# EAGLE schematic Processor (EAGLE 9.3.0)
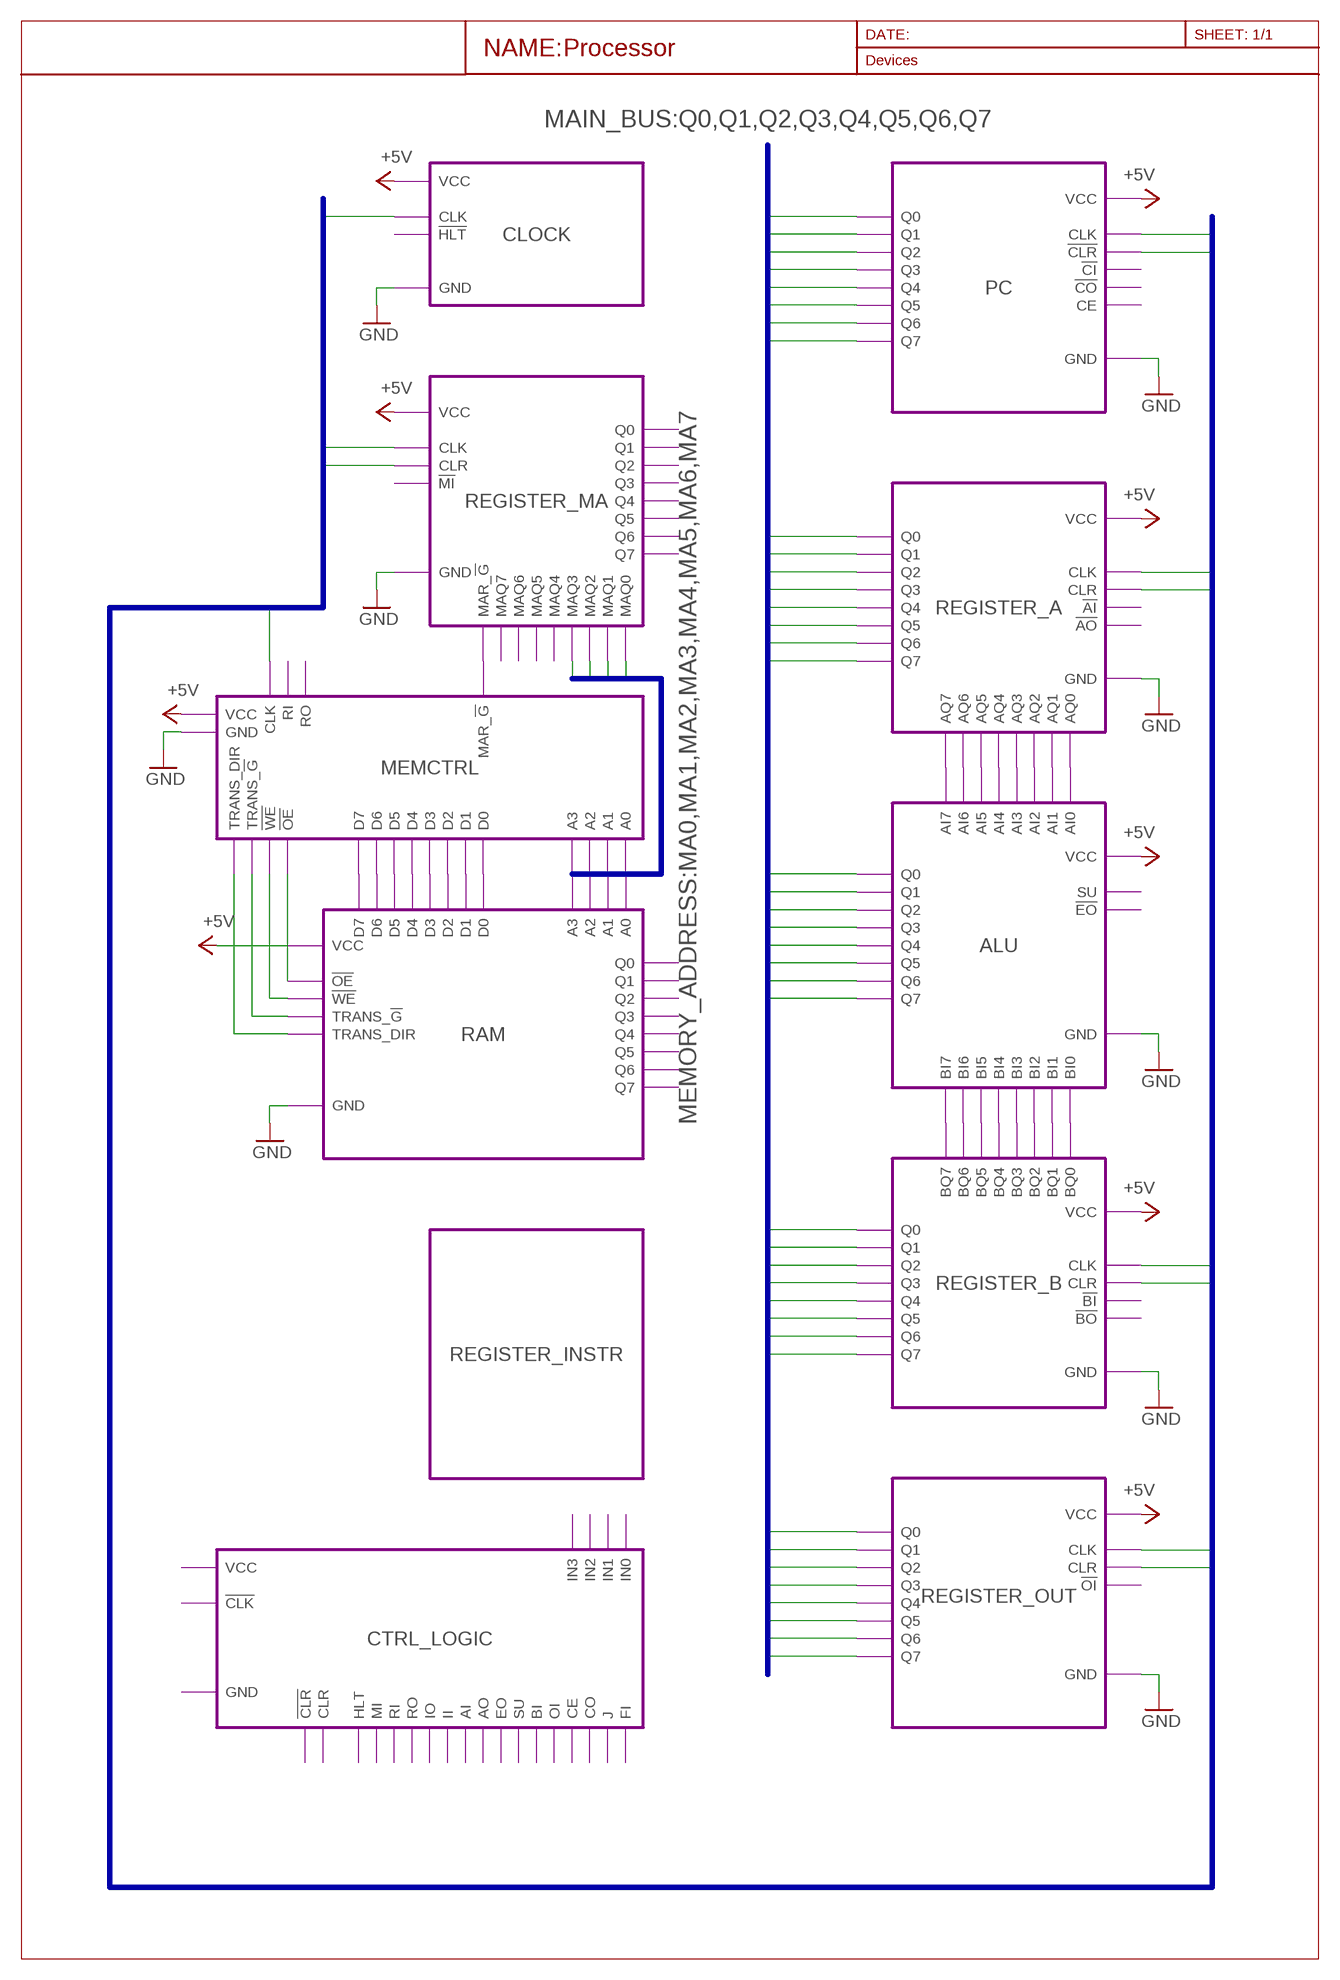
[diagram p0: schematic, sheet 1]

## Module instances
REGISTER_A = REGISTER_A
REGISTER_B = REGISTER_B
ALU = ALU
REGISTER_OUT = REGISTER_OUT
PC = PC
CLOCK = CLOCK
REGISTER_MA = REGISTER_MA
RAM = RAM
MEMCTRL = MEMCTRL
REGISTER_INSTR = REGISTER_INSTR
CTRL_LOGIC = CTRL_LOGIC

## Nets
!CLR: port PC.!CLR
+5V: port REGISTER_B.VCC ALU.VCC REGISTER_A.VCC REGISTER_OUT.VCC PC.VCC CLOCK.VCC REGISTER_MA.VCC RAM.VCC MEMCTRL.VCC
CLK: port PC.CLK REGISTER_A.CLK REGISTER_B.CLK REGISTER_OUT.CLK MEMCTRL.CLK REGISTER_MA.CLK CLOCK.CLK
CLR: port REGISTER_A.CLR REGISTER_B.CLR REGISTER_OUT.CLR REGISTER_MA.CLR
GND: port REGISTER_A.GND ALU.GND REGISTER_B.GND REGISTER_OUT.GND PC.GND CLOCK.GND REGISTER_MA.GND RAM.GND MEMCTRL.GND
MA0: port REGISTER_MA.MAQ0 MEMCTRL.A0 RAM.A0
MA1: port REGISTER_MA.MAQ1 MEMCTRL.A1 RAM.A1
MA2: port REGISTER_MA.MAQ2 MEMCTRL.A2 RAM.A2
MA3: port REGISTER_MA.MAQ3 MEMCTRL.A3 RAM.A3
N$5: port REGISTER_MA.MAR_!G MEMCTRL.MAR_!G
N$18: port REGISTER_A.AQ7 ALU.AI7
N$19: port REGISTER_A.AQ6 ALU.AI6
N$27: port MEMCTRL.D7 RAM.D7
N$28: port MEMCTRL.D6 RAM.D6
N$29: port REGISTER_A.AQ5 ALU.AI5
N$30: port MEMCTRL.D5 RAM.D5
N$45: port REGISTER_A.AQ4 ALU.AI4
N$46: port REGISTER_A.AQ3 ALU.AI3
N$47: port REGISTER_A.AQ2 ALU.AI2
N$48: port REGISTER_A.AQ1 ALU.AI1
N$49: port REGISTER_A.AQ0 ALU.AI0
N$50: port ALU.BI0 REGISTER_B.BQ0
N$51: port MEMCTRL.D4 RAM.D4
N$52: port ALU.BI1 REGISTER_B.BQ1
N$53: port ALU.BI2 REGISTER_B.BQ2
N$54: port ALU.BI3 REGISTER_B.BQ3
N$55: port ALU.BI4 REGISTER_B.BQ4
N$56: port ALU.BI5 REGISTER_B.BQ5
N$57: port ALU.BI6 REGISTER_B.BQ6
N$58: port ALU.BI7 REGISTER_B.BQ7
N$59: port MEMCTRL.D3 RAM.D3
N$60: port MEMCTRL.D2 RAM.D2
N$61: port MEMCTRL.D1 RAM.D1
N$62: port MEMCTRL.D0 RAM.D0
N$63: port RAM.TRANS_DIR MEMCTRL.TRANS_DIR
N$64: port RAM.TRANS_!G MEMCTRL.TRANS_!G
N$65: port RAM.!WE MEMCTRL.!WE
N$66: port RAM.!OE MEMCTRL.!OE
Q0: port REGISTER_A.Q0 ALU.Q0 REGISTER_B.Q0 REGISTER_OUT.Q0 PC.Q0
Q1: port REGISTER_A.Q1 ALU.Q1 REGISTER_B.Q1 REGISTER_OUT.Q1 PC.Q1
Q2: port REGISTER_A.Q2 ALU.Q2 REGISTER_B.Q2 REGISTER_OUT.Q2 PC.Q2
Q3: port REGISTER_A.Q3 ALU.Q3 REGISTER_B.Q3 REGISTER_OUT.Q3 PC.Q3
Q4: port REGISTER_A.Q4 ALU.Q4 REGISTER_B.Q4 REGISTER_OUT.Q4 PC.Q4
Q5: port REGISTER_A.Q5 ALU.Q5 REGISTER_B.Q5 REGISTER_OUT.Q5 PC.Q5
Q6: port REGISTER_A.Q6 ALU.Q6 REGISTER_B.Q6 REGISTER_OUT.Q6 PC.Q6
Q7: port REGISTER_A.Q7 ALU.Q7 REGISTER_B.Q7 REGISTER_OUT.Q7 PC.Q7

## Buses
MAIN_BUS:Q0,Q1,Q2,Q3,Q4,Q5,Q6,Q7
MEMORY_ADDRESS:MA0,MA1,MA2,MA3,MA4,MA5,MA6,MA7
CTRL_BUS:CLK,CLR,!CLR

## Library data of the parts

## Module REGISTER_A
Ports: Q0(io) Q1(io) Q2(io) Q3(io) Q4(io) Q5(io) Q6(io) Q7(io) AQ7(out) AQ6(out) AQ5(out) AQ4(out) AQ3(out) AQ2(out) AQ1(out) AQ0(out) CLK(in) CLR(in) !AI(in) !AO(in) VCC(pwr) GND(pwr)
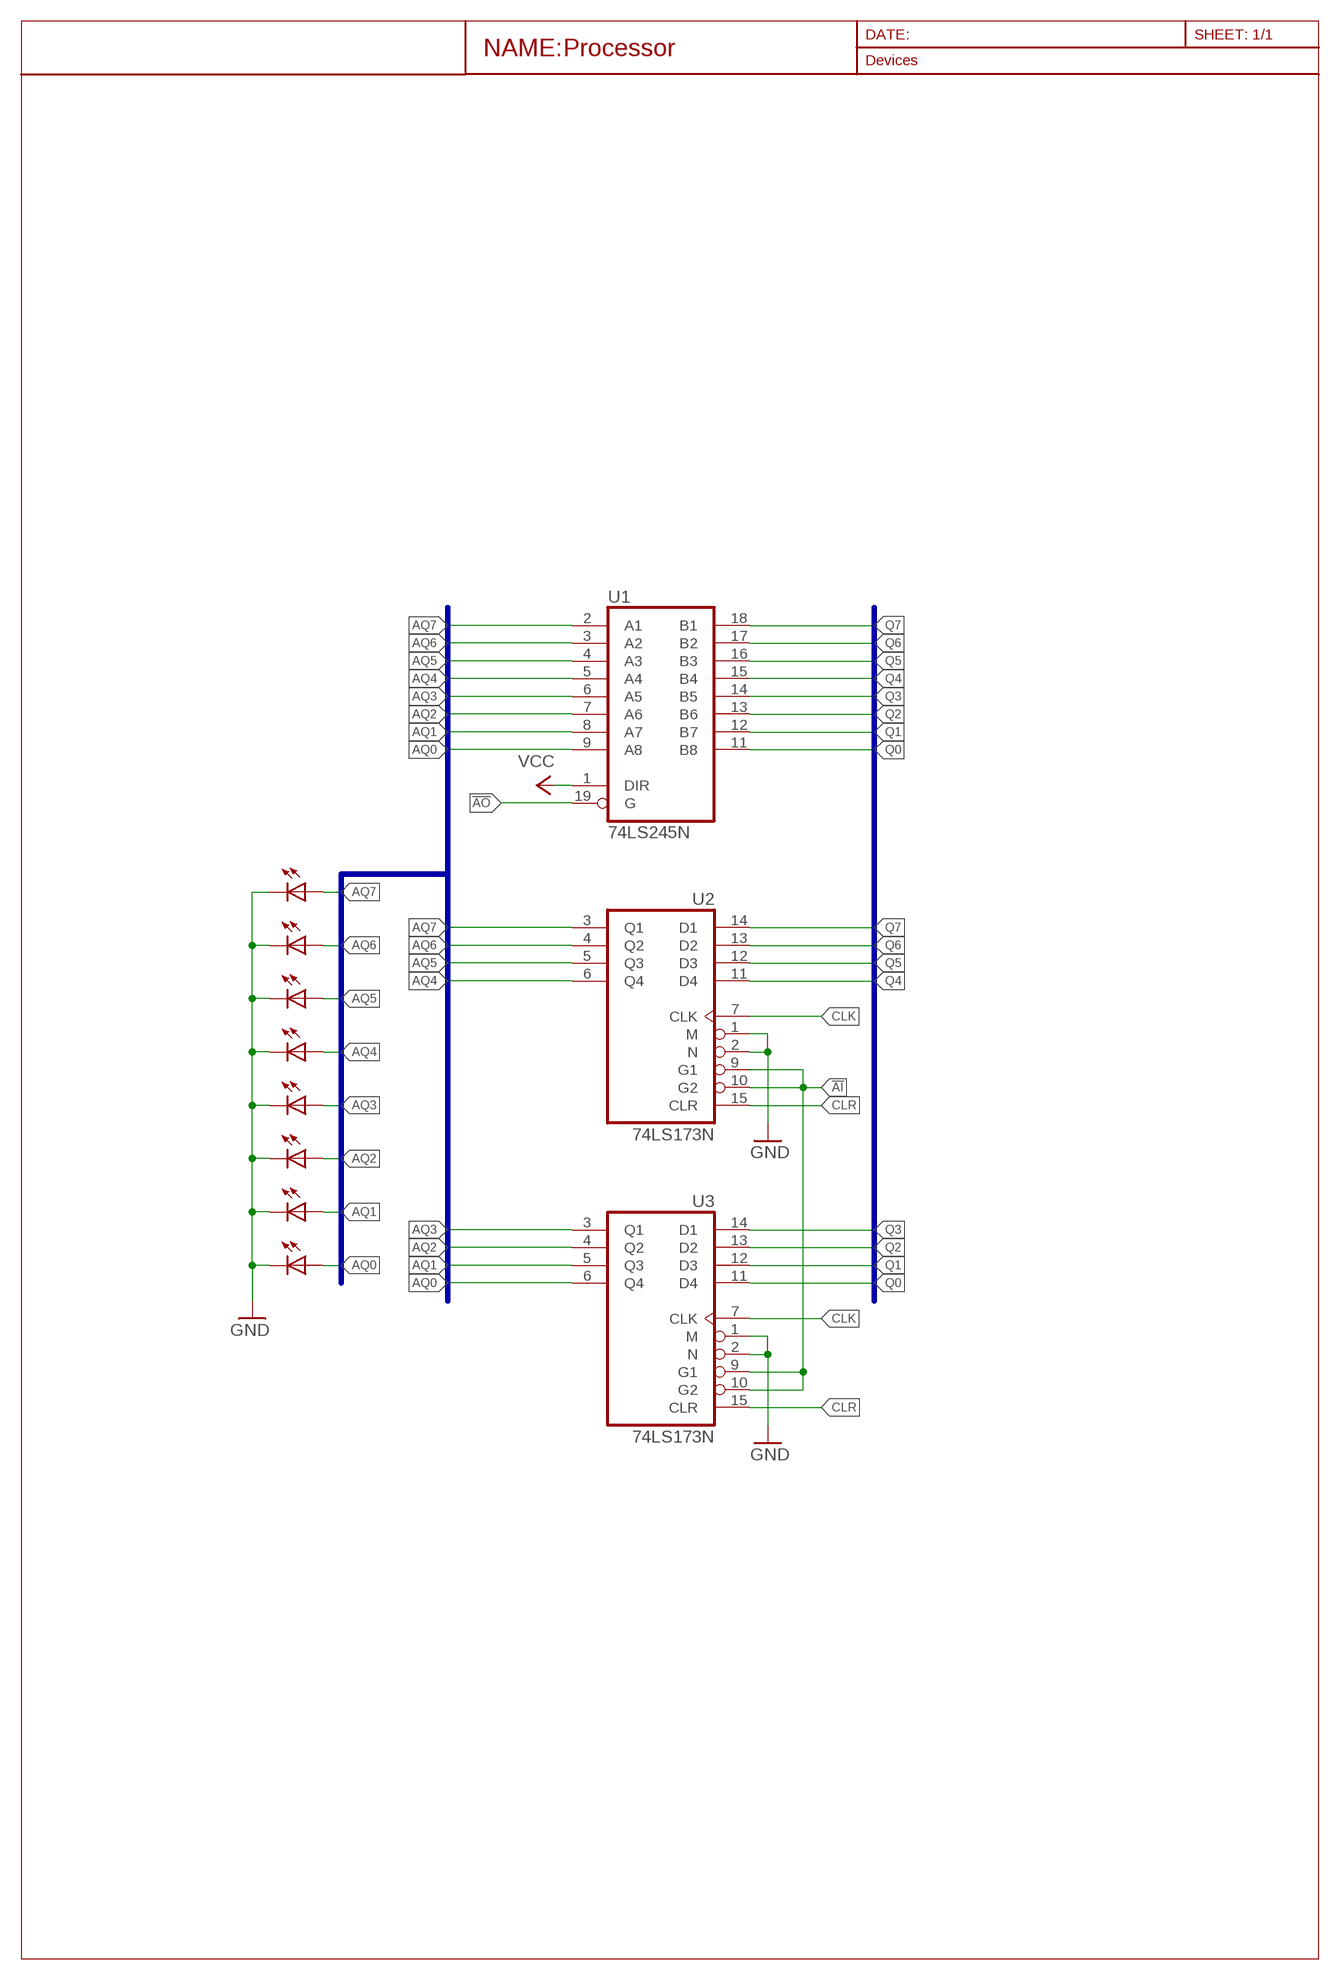
[diagram p1: schematic, module REGISTER_A, sheet 1]

### Parts
LED1  LED5MM  [LED5MM]
LED2  LED5MM  [LED5MM]
LED3  LED5MM  [LED5MM]
LED4  LED5MM  [LED5MM]
LED5  LED5MM  [LED5MM]
LED6  LED5MM  [LED5MM]
LED7  LED5MM  [LED5MM]
LED8  LED5MM  [LED5MM]
U1  74LS245N  [DIL20]
U2  74LS173N  [DIL16]
U3  74LS173N  [DIL16]

### Nets
!AI: U2.9(G1) U2.10(G2) U3.9(G1) U3.10(G2)
!AO: U1.19(G)
AQ0: LED1.A U1.9(A8) U3.6(Q4)
AQ1: LED2.A U1.8(A7) U3.5(Q3)
AQ2: LED3.A U1.7(A6) U3.4(Q2)
AQ3: LED4.A U1.6(A5) U3.3(Q1)
AQ4: LED5.A U1.5(A4) U2.6(Q4)
AQ5: LED6.A U1.4(A3) U2.5(Q3)
AQ6: LED7.A U1.3(A2) U2.4(Q2)
AQ7: LED8.A U1.2(A1) U2.3(Q1)
CLK: U2.7(CLK) U3.7(CLK)
CLR: U2.15(CLR) U3.15(CLR)
GND: LED1.K(C) LED2.K(C) LED3.K(C) LED4.K(C) LED5.K(C) LED6.K(C) LED7.K(C) LED8.K(C) U2.1(M) U2.2(N) U3.1(M) U3.2(N)
Q0: U1.11(B8) U3.11(D4)
Q1: U1.12(B7) U3.12(D3)
Q2: U1.13(B6) U3.13(D2)
Q3: U1.14(B5) U3.14(D1)
Q4: U1.15(B4) U2.11(D4)
Q5: U1.16(B3) U2.12(D3)
Q6: U1.17(B2) U2.13(D2)
Q7: U1.18(B1) U2.14(D1)
VCC: U1.1(DIR)

### Buses
AQ0,AQ1,AQ2,AQ3,AQ4,AQ5,AQ6,AQ7
Q0,Q1,Q2,Q3,Q4,Q5,Q6,Q7

### Power pins joined to a net without a drawn wire
GND: U1.10(GND) U2.8(GND) U3.8(GND)
VCC: U1.20(VCC) U2.16(VCC) U3.16(VCC)

### Library data of the parts
LED1-LED8 = led:LED: LED OSRAM: - CHIPLED LG R971, LG N971, LY N971, LG Q971, LY Q971, LO R971, LY R971 LH N974, LH R974 LS Q976, LO Q976, LY Q976 LO Q996 - Hyper CHIPLED LW Q18S LB Q993, LB Q99A, LB R99A - SideLED LS A670, LO A670, LY A670, LG A670, LP A670 LB A673, LV A673, LT A673, LW A673 LH A674 LY A675 LS A676, LA A676, LO A676, LY A676, LW A676 LS A679, LY A679, LG A679 - Hyper Micro SIDELED® LS Y876, LA Y876, LO Y876, LY Y876 LT Y87S - SmartLED LW L88C, LW L88S LB L89C, LB L89S, LG L890 LS L89K, LO L89K, LY L89K LS L896, LA L896, LO L896, LY L896 - TOPLED LS T670, LO T670, LY T670, LG T670, LP T670 LSG T670, LSP T670, LSY T670, LOP T670, LYG T670 LG T671, LOG T671, LSG T671 LB T673, LV T673, LT T673, LW T673 LH T674 LS T676, LA T676, LO T676, LY T676, LB T676, LH T676, LSB T676, LW T676 LB T67C, LV T67C, LT T67C, LS T67K, LO T67K, LY T67K, LW E67C LS E67B, LA E67B, LO E67B, LY E67B, LB E67C, LV E67C, LT E67C LW T67C LS T679, LY T679, LG T679 LS T770, LO T770, LY T770, LG T770, LP T770 LB T773, LV T773, LT T773, LW T773 LH T774 LS E675, LA E675, LY E675, LS T675 LS T776, LA T776, LO T776, LY T776, LB T776 LHGB T686 LT T68C, LB T68C - Hyper Mini TOPLED® LB M676 - Mini TOPLED Santana® LG M470 LS M47K, LO M47K, LY M47K Source: http://www.osram.convergy.de LUXEON: - LUMILED® LXK2-PW12-R00, LXK2-PW12-S00, LXK2-PW14-U00, LXK2-PW14-V00 LXK2-PM12-R00, LXK2-PM12-S00, LXK2-PM14-U00 LXK2-PE12-Q00, LXK2-PE12-R00, LXK2-PE12-S00, LXK2-PE14-T00, LXK2-PE14-U00 LXK2-PB12-K00, LXK2-PB12-L00, LXK2-PB12-M00, LXK2-PB14-N00, LXK2-PB14-P00, LXK2-PB14-Q00 LXK2-PR12-L00, LXK2-PR12-M00, LXK2-PR14-Q00, LXK2-PR14-R00 LXK2-PD12-Q00, LXK2-PD12-R00, LXK2-PD12-S00 LXK2-PH12-R00, LXK2-PH12-S00 LXK2-PL12-P00, LXK2-PL12-Q00, LXK2-PL12-R00 Source: www.luxeon.com KINGBRIGHT: KA-3528ASYC Source: www.kingbright.com
U1 = 74xx-eu:74*245: Octal BUS TRANSCEIVER, 3-state
U2 U3 = 74xx-eu:74*173: 4-bit D type REGISTER, 3-state

## Module REGISTER_B
Ports: VCC(pwr) GND(pwr) CLK(in) CLR(in) !BI(in) !BO(in) Q0(io) Q1(io) Q2(io) Q3(io) Q4(io) Q5(io) Q6(io) Q7(io) BQ0(out) BQ1(out) BQ2(out) BQ3(out) BQ4(out) BQ5(out) BQ6(out) BQ7(out)
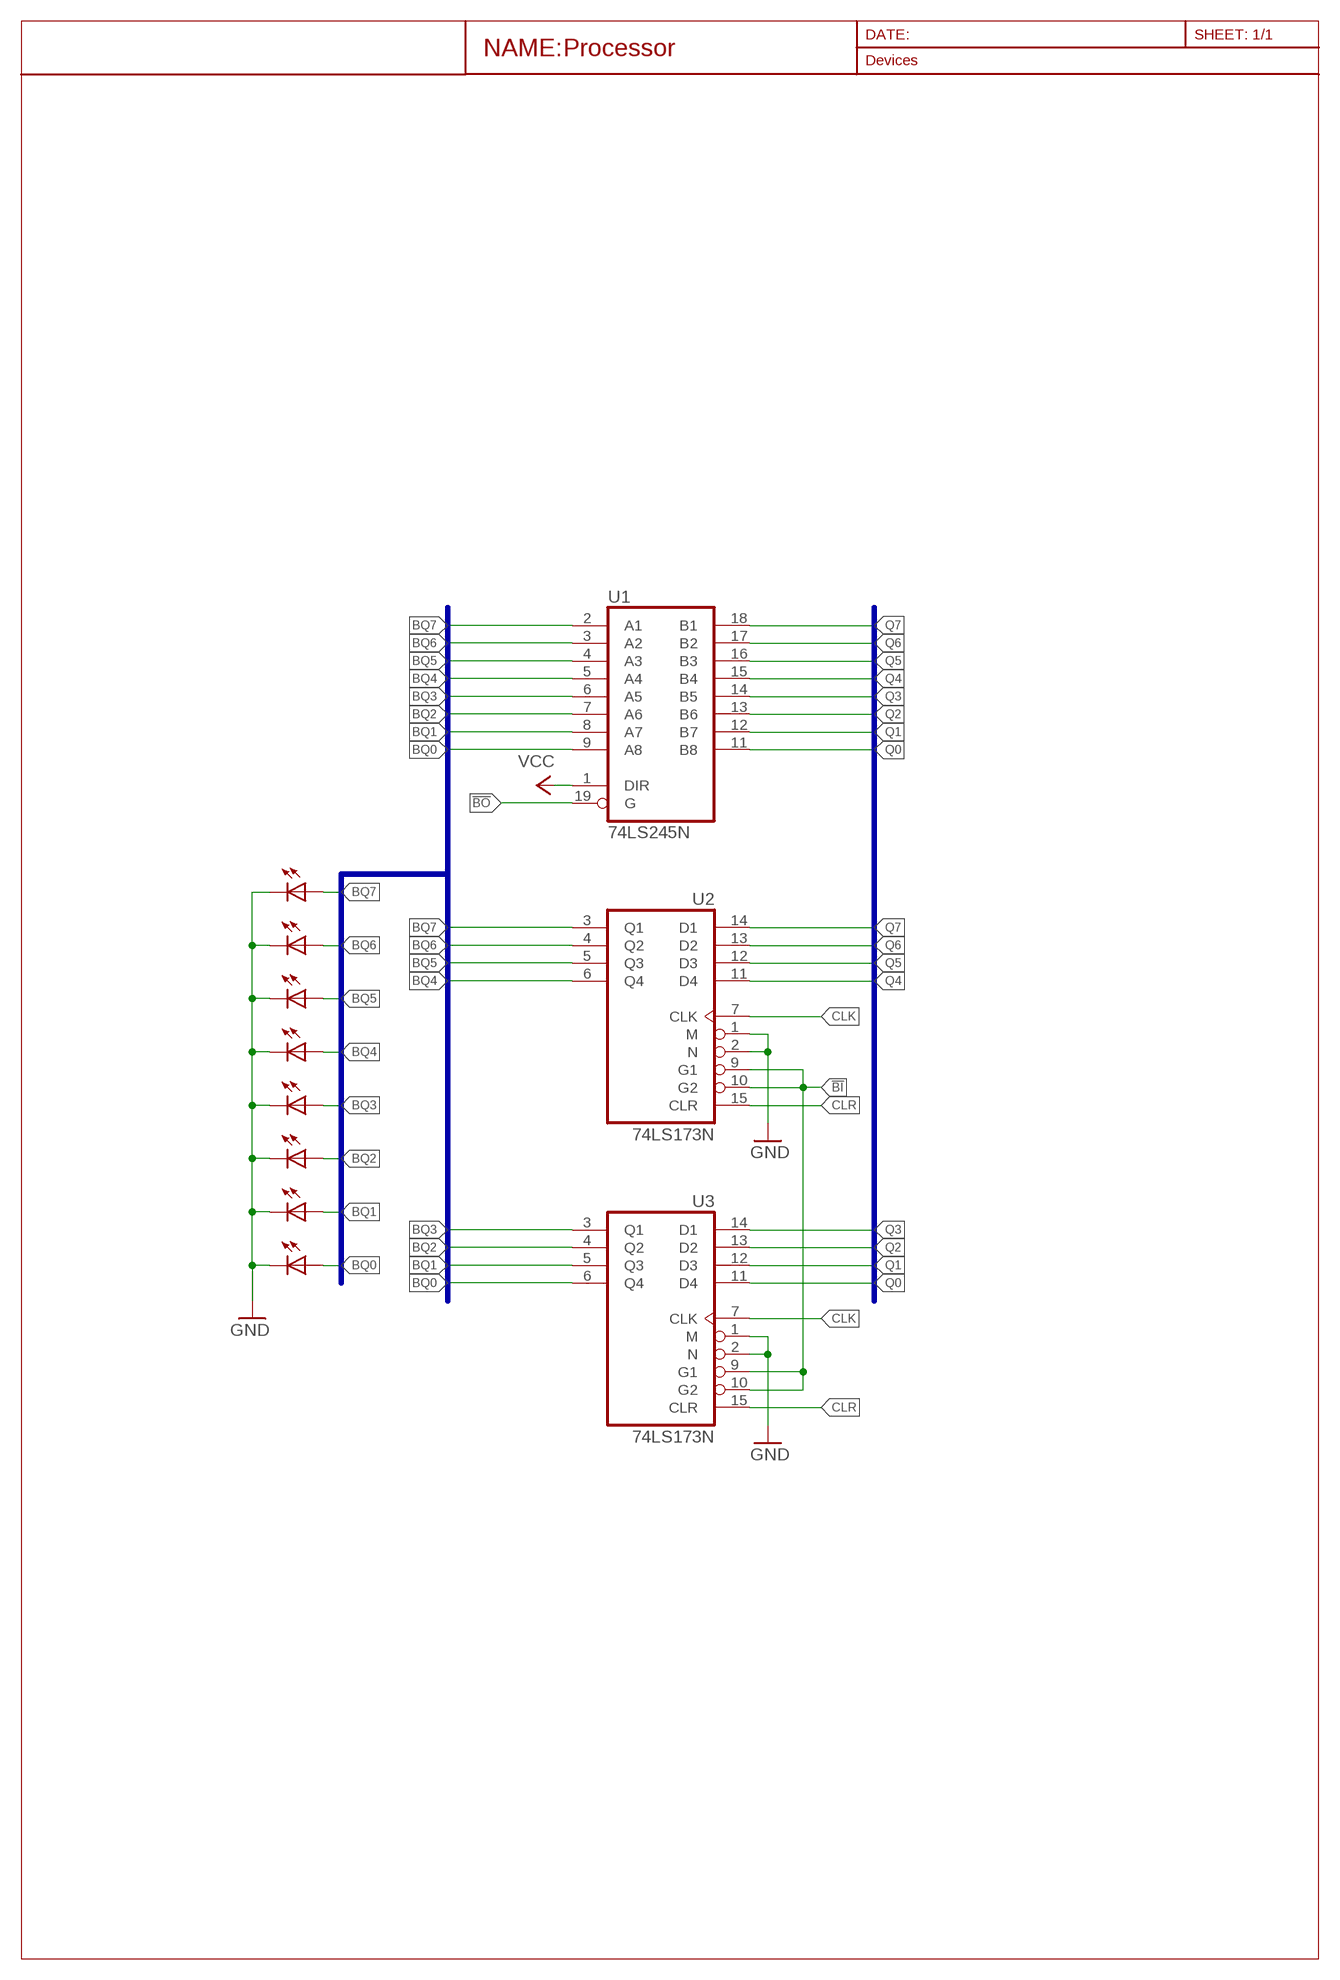
[diagram p2: schematic, module REGISTER_B, sheet 1]

### Parts
LED9  LED5MM  [LED5MM]
LED10  LED5MM  [LED5MM]
LED11  LED5MM  [LED5MM]
LED12  LED5MM  [LED5MM]
LED13  LED5MM  [LED5MM]
LED14  LED5MM  [LED5MM]
LED15  LED5MM  [LED5MM]
LED16  LED5MM  [LED5MM]
U1  74LS245N  [DIL20]
U2  74LS173N  [DIL16]
U3  74LS173N  [DIL16]

### Nets
!BI: U2.9(G1) U2.10(G2) U3.9(G1) U3.10(G2)
!BO: U1.19(G)
BQ0: LED9.A U1.9(A8) U3.6(Q4)
BQ1: LED10.A U1.8(A7) U3.5(Q3)
BQ2: LED11.A U1.7(A6) U3.4(Q2)
BQ3: LED12.A U1.6(A5) U3.3(Q1)
BQ4: LED13.A U1.5(A4) U2.6(Q4)
BQ5: LED14.A U1.4(A3) U2.5(Q3)
BQ6: LED15.A U1.3(A2) U2.4(Q2)
BQ7: LED16.A U1.2(A1) U2.3(Q1)
CLK: U2.7(CLK) U3.7(CLK)
CLR: U2.15(CLR) U3.15(CLR)
GND: LED9.K(C) LED10.K(C) LED11.K(C) LED12.K(C) LED13.K(C) LED14.K(C) LED15.K(C) LED16.K(C) U2.1(M) U2.2(N) U3.1(M) U3.2(N)
Q0: U1.11(B8) U3.11(D4)
Q1: U1.12(B7) U3.12(D3)
Q2: U1.13(B6) U3.13(D2)
Q3: U1.14(B5) U3.14(D1)
Q4: U1.15(B4) U2.11(D4)
Q5: U1.16(B3) U2.12(D3)
Q6: U1.17(B2) U2.13(D2)
Q7: U1.18(B1) U2.14(D1)
VCC: U1.1(DIR)

### Buses
Q0,Q1,Q2,Q3,Q4,Q5,Q6,Q7
BQ0,BQ1,BQ2,BQ3,BQ4,BQ5,BQ6,BQ7

### Power pins joined to a net without a drawn wire
GND: U1.10(GND) U2.8(GND) U3.8(GND)
VCC: U1.20(VCC) U2.16(VCC) U3.16(VCC)

### Library data of the parts
LED9-LED16 = led:LED: LED OSRAM: - CHIPLED LG R971, LG N971, LY N971, LG Q971, LY Q971, LO R971, LY R971 LH N974, LH R974 LS Q976, LO Q976, LY Q976 LO Q996 - Hyper CHIPLED LW Q18S LB Q993, LB Q99A, LB R99A - SideLED LS A670, LO A670, LY A670, LG A670, LP A670 LB A673, LV A673, LT A673, LW A673 LH A674 LY A675 LS A676, LA A676, LO A676, LY A676, LW A676 LS A679, LY A679, LG A679 - Hyper Micro SIDELED® LS Y876, LA Y876, LO Y876, LY Y876 LT Y87S - SmartLED LW L88C, LW L88S LB L89C, LB L89S, LG L890 LS L89K, LO L89K, LY L89K LS L896, LA L896, LO L896, LY L896 - TOPLED LS T670, LO T670, LY T670, LG T670, LP T670 LSG T670, LSP T670, LSY T670, LOP T670, LYG T670 LG T671, LOG T671, LSG T671 LB T673, LV T673, LT T673, LW T673 LH T674 LS T676, LA T676, LO T676, LY T676, LB T676, LH T676, LSB T676, LW T676 LB T67C, LV T67C, LT T67C, LS T67K, LO T67K, LY T67K, LW E67C LS E67B, LA E67B, LO E67B, LY E67B, LB E67C, LV E67C, LT E67C LW T67C LS T679, LY T679, LG T679 LS T770, LO T770, LY T770, LG T770, LP T770 LB T773, LV T773, LT T773, LW T773 LH T774 LS E675, LA E675, LY E675, LS T675 LS T776, LA T776, LO T776, LY T776, LB T776 LHGB T686 LT T68C, LB T68C - Hyper Mini TOPLED® LB M676 - Mini TOPLED Santana® LG M470 LS M47K, LO M47K, LY M47K Source: http://www.osram.convergy.de LUXEON: - LUMILED® LXK2-PW12-R00, LXK2-PW12-S00, LXK2-PW14-U00, LXK2-PW14-V00 LXK2-PM12-R00, LXK2-PM12-S00, LXK2-PM14-U00 LXK2-PE12-Q00, LXK2-PE12-R00, LXK2-PE12-S00, LXK2-PE14-T00, LXK2-PE14-U00 LXK2-PB12-K00, LXK2-PB12-L00, LXK2-PB12-M00, LXK2-PB14-N00, LXK2-PB14-P00, LXK2-PB14-Q00 LXK2-PR12-L00, LXK2-PR12-M00, LXK2-PR14-Q00, LXK2-PR14-R00 LXK2-PD12-Q00, LXK2-PD12-R00, LXK2-PD12-S00 LXK2-PH12-R00, LXK2-PH12-S00 LXK2-PL12-P00, LXK2-PL12-Q00, LXK2-PL12-R00 Source: www.luxeon.com KINGBRIGHT: KA-3528ASYC Source: www.kingbright.com
U1 = 74xx-eu:74*245: Octal BUS TRANSCEIVER, 3-state
U2 U3 = 74xx-eu:74*173: 4-bit D type REGISTER, 3-state

## Module ALU
Ports: Q0(out) Q1(out) Q2(out) Q3(out) Q4(out) Q5(out) Q6(out) Q7(out) AI7(in) AI6(in) AI5(in) AI4(in) AI3(in) AI2(in) AI1(in) AI0(in) BI7(in) BI6(in) BI5(in) BI4(in) BI3(in) BI2(in) BI1(in) BI0(in) VCC(pwr) GND(pwr) SU(in) !EO(in)
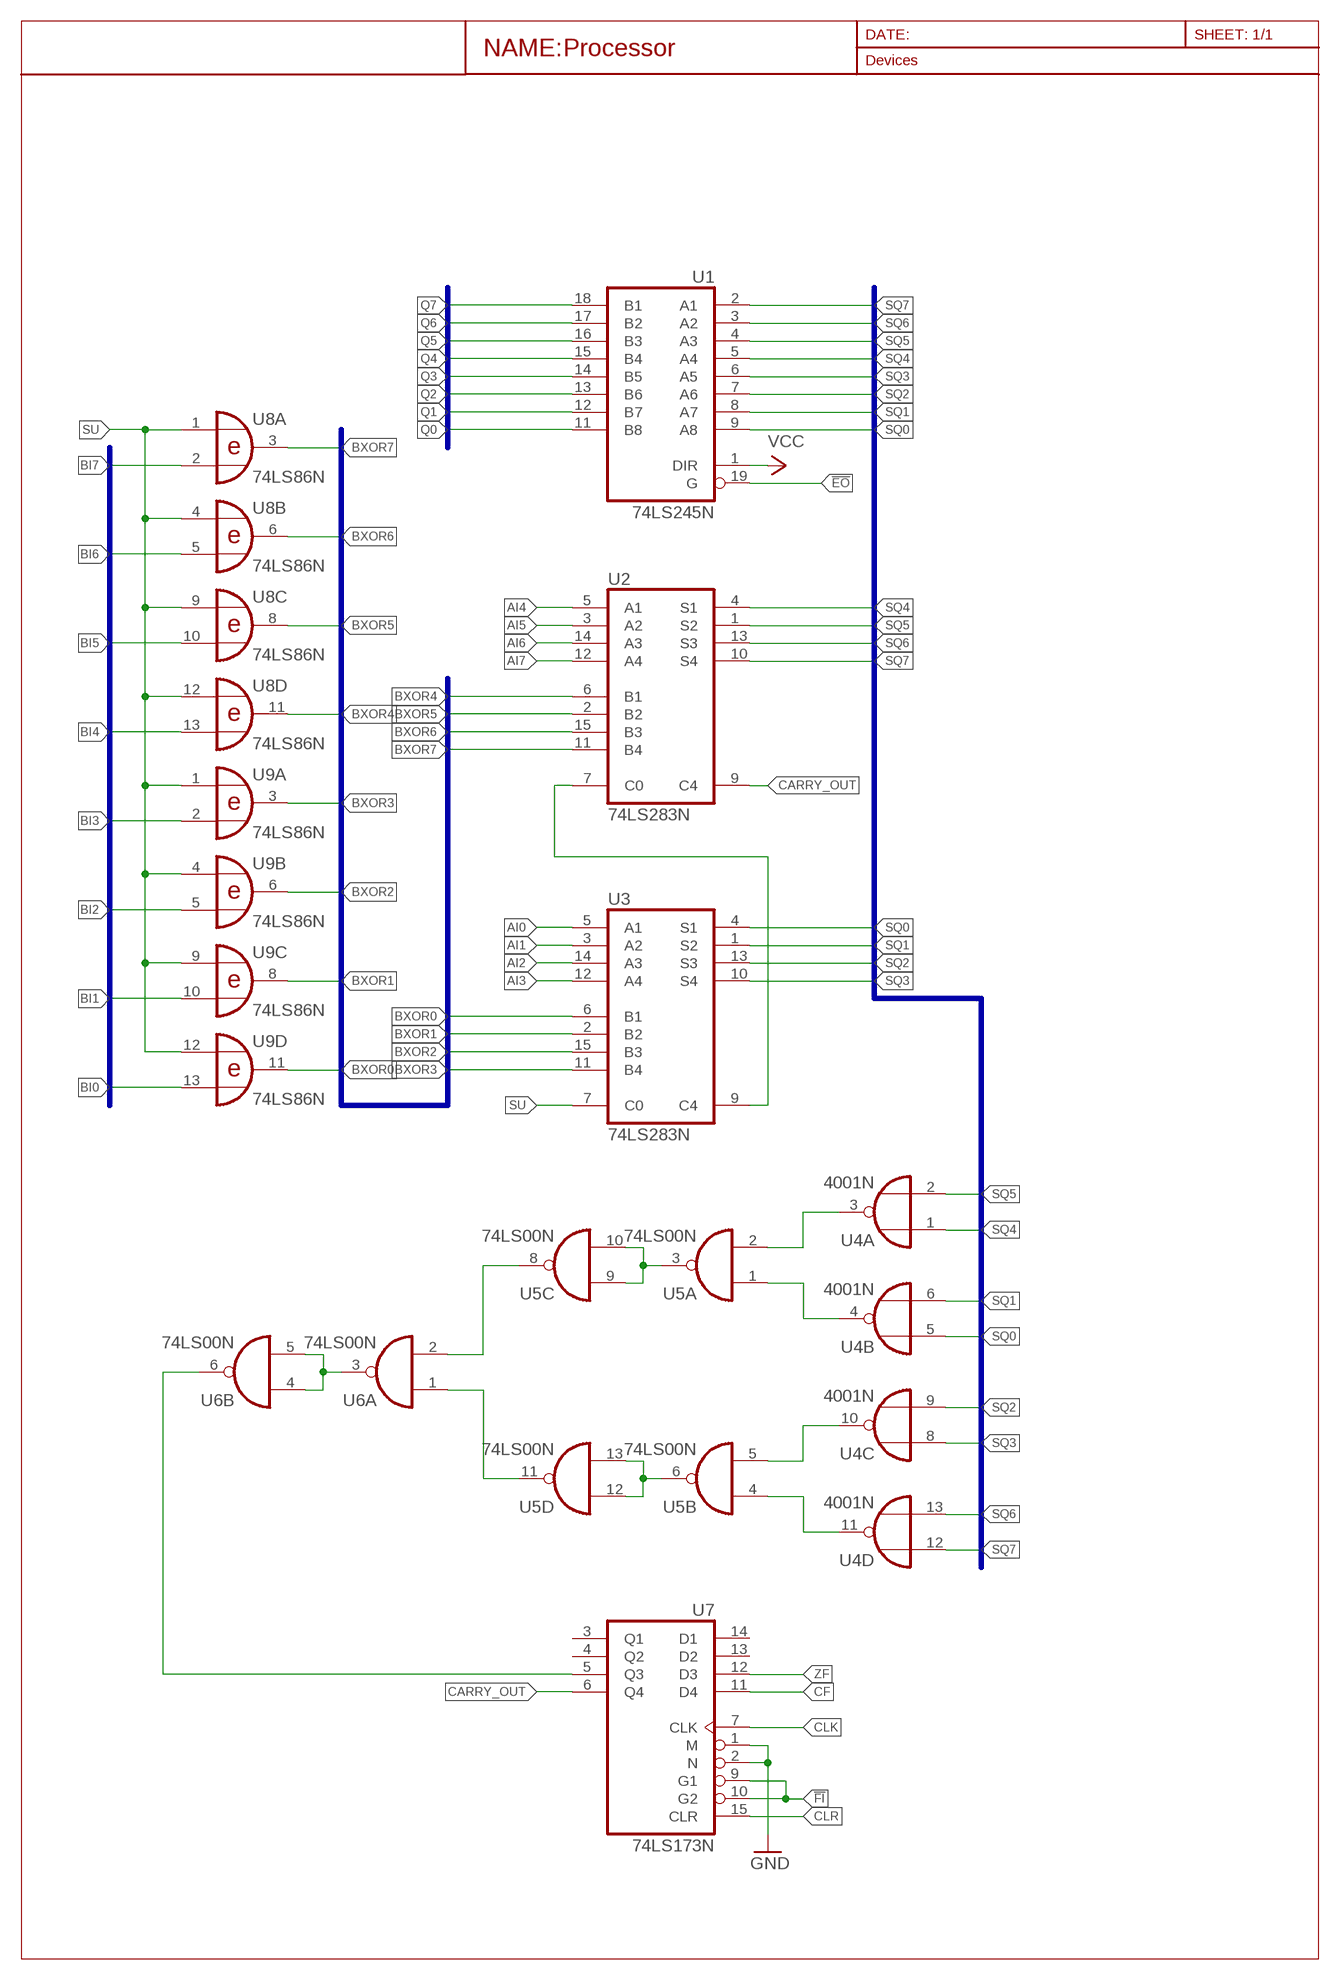
[diagram p3: schematic, module ALU, sheet 1]

### Parts
U1  74LS245N  [DIL20]
U2  74LS283N  [DIL16]
U3  74LS283N  [DIL16]
U4  4001N  [DIL14]
U5  74LS00N  [DIL14]
U6  74LS00N  [DIL14]
U7  74LS173N  [DIL16]
U8  74LS86N  [DIL14]
U9  74LS86N  [DIL14]

### Nets
!EO: U1.19(G)
!FI: U7.9(G1) U7.10(G2)
AI0: U3.5(A1)
AI1: U3.3(A2)
AI2: U3.14(A3)
AI3: U3.12(A4)
AI4: U2.5(A1)
AI5: U2.3(A2)
AI6: U2.14(A3)
AI7: U2.12(A4)
BI0: U9.13(D:I1)
BI1: U9.10(C:I1)
BI2: U9.5(B:I1)
BI3: U9.2(A:I1)
BI4: U8.13(D:I1)
BI5: U8.10(C:I1)
BI6: U8.5(B:I1)
BI7: U8.2(A:I1)
BXOR0: U3.6(B1) U9.11(D:O)
BXOR1: U3.2(B2) U9.8(C:O)
BXOR2: U3.15(B3) U9.6(B:O)
BXOR3: U3.11(B4) U9.3(A:O)
BXOR4: U2.6(B1) U8.11(D:O)
BXOR5: U2.2(B2) U8.8(C:O)
BXOR6: U2.15(B3) U8.6(B:O)
BXOR7: U2.11(B4) U8.3(A:O)
CARRY_OUT: U2.9(C4) U7.6(Q4)
CF: U7.11(D4)
CLK: U7.7(CLK)
CLR: U7.15(CLR)
E_CARRY: U2.7(C0) U3.9(C4)
GND: U7.1(M) U7.2(N)
N$1: U6.6(B:O) U7.5(Q3)
N$2: U6.3(A:O) U6.4(B:I0) U6.5(B:I1)
N$3: U5.11(D:O) U6.1(A:I0)
N$4: U5.8(C:O) U6.2(A:I1)
N$5: U5.6(B:O) U5.12(D:I0) U5.13(D:I1)
N$6: U5.3(A:O) U5.9(C:I0) U5.10(C:I1)
N$7: U4.11(D:O) U5.4(B:I0)
N$8: U4.10(C:O) U5.5(B:I1)
N$9: U4.4(B:O) U5.1(A:I0)
N$10: U4.3(A:O) U5.2(A:I1)
Q0: U1.11(B8)
Q1: U1.12(B7)
Q2: U1.13(B6)
Q3: U1.14(B5)
Q4: U1.15(B4)
Q5: U1.16(B3)
Q6: U1.17(B2)
Q7: U1.18(B1)
SQ0: U1.9(A8) U3.4(S1) U4.5(B:I0)
SQ1: U1.8(A7) U3.1(S2) U4.6(B:I1)
SQ2: U1.7(A6) U3.13(S3) U4.9(C:I1)
SQ3: U1.6(A5) U3.10(S4) U4.8(C:I0)
SQ4: U1.5(A4) U2.4(S1) U4.1(A:I0)
SQ5: U1.4(A3) U2.1(S2) U4.2(A:I1)
SQ6: U1.3(A2) U2.13(S3) U4.13(D:I1)
SQ7: U1.2(A1) U2.10(S4) U4.12(D:I0)
SU: U3.7(C0) U8.1(A:I0) U8.4(B:I0) U8.9(C:I0) U8.12(D:I0) U9.1(A:I0) U9.4(B:I0) U9.9(C:I0) U9.12(D:I0)
VCC: U1.1(DIR)
ZF: U7.12(D3)
Unconnected: U6.8(C:O) U6.9(C:I0) U6.10(C:I1) U6.11(D:O) U6.12(D:I0) U6.13(D:I1) U7.3(Q1) U7.4(Q2) U7.13(D2) U7.14(D1)

### Buses
SQ0,SQ1,SQ2,SQ3,SQ4,SQ5,SQ6,SQ7
Q0,Q1,Q2,Q3,Q4,Q5,Q6,Q7
BXOR0,BXOR1,BXOR2,BXOR3,BXOR4,BXOR5,BXOR6,BXOR7
BI0,BI1,BI2,BI3,BI4,BI5,BI6,BI7

### Power pins joined to a net without a drawn wire
GND: U1.10(GND) U2.8(GND) U3.8(GND) U5.7(P:GND) U6.7(P:GND) U7.8(GND) U8.7(P:GND) U9.7(P:GND)
VCC: U1.20(VCC) U2.16(VCC) U3.16(VCC) U5.14(P:VCC) U6.14(P:VCC) U7.16(VCC) U8.14(P:VCC) U9.14(P:VCC)
VDD: U4.14(P:VDD)
VSS: U4.7(P:VSS)

### Library data of the parts
U1 = 74xx-eu:74*245: Octal BUS TRANSCEIVER, 3-state
U2 U3 = 74xx-eu:74*283: 4-bit binary FULL ADDER, fast carry
U4 = 40xx:4001: Quad 2-input NOR
U5 U6 = 74xx-eu:74*00: Quad 2-input NAND gate
U7 = 74xx-eu:74*173: 4-bit D type REGISTER, 3-state
U8 U9 = 74xx-eu:74*86: Quad 2-input EXCLUSIVE-OR (XOR) gate

## Module REGISTER_OUT
Ports: VCC(pwr) GND(pwr) Q0(in) Q1(in) Q2(in) Q3(in) Q4(in) Q5(in) Q6(in) Q7(in) CLK(in) CLR(in) !OI(in)
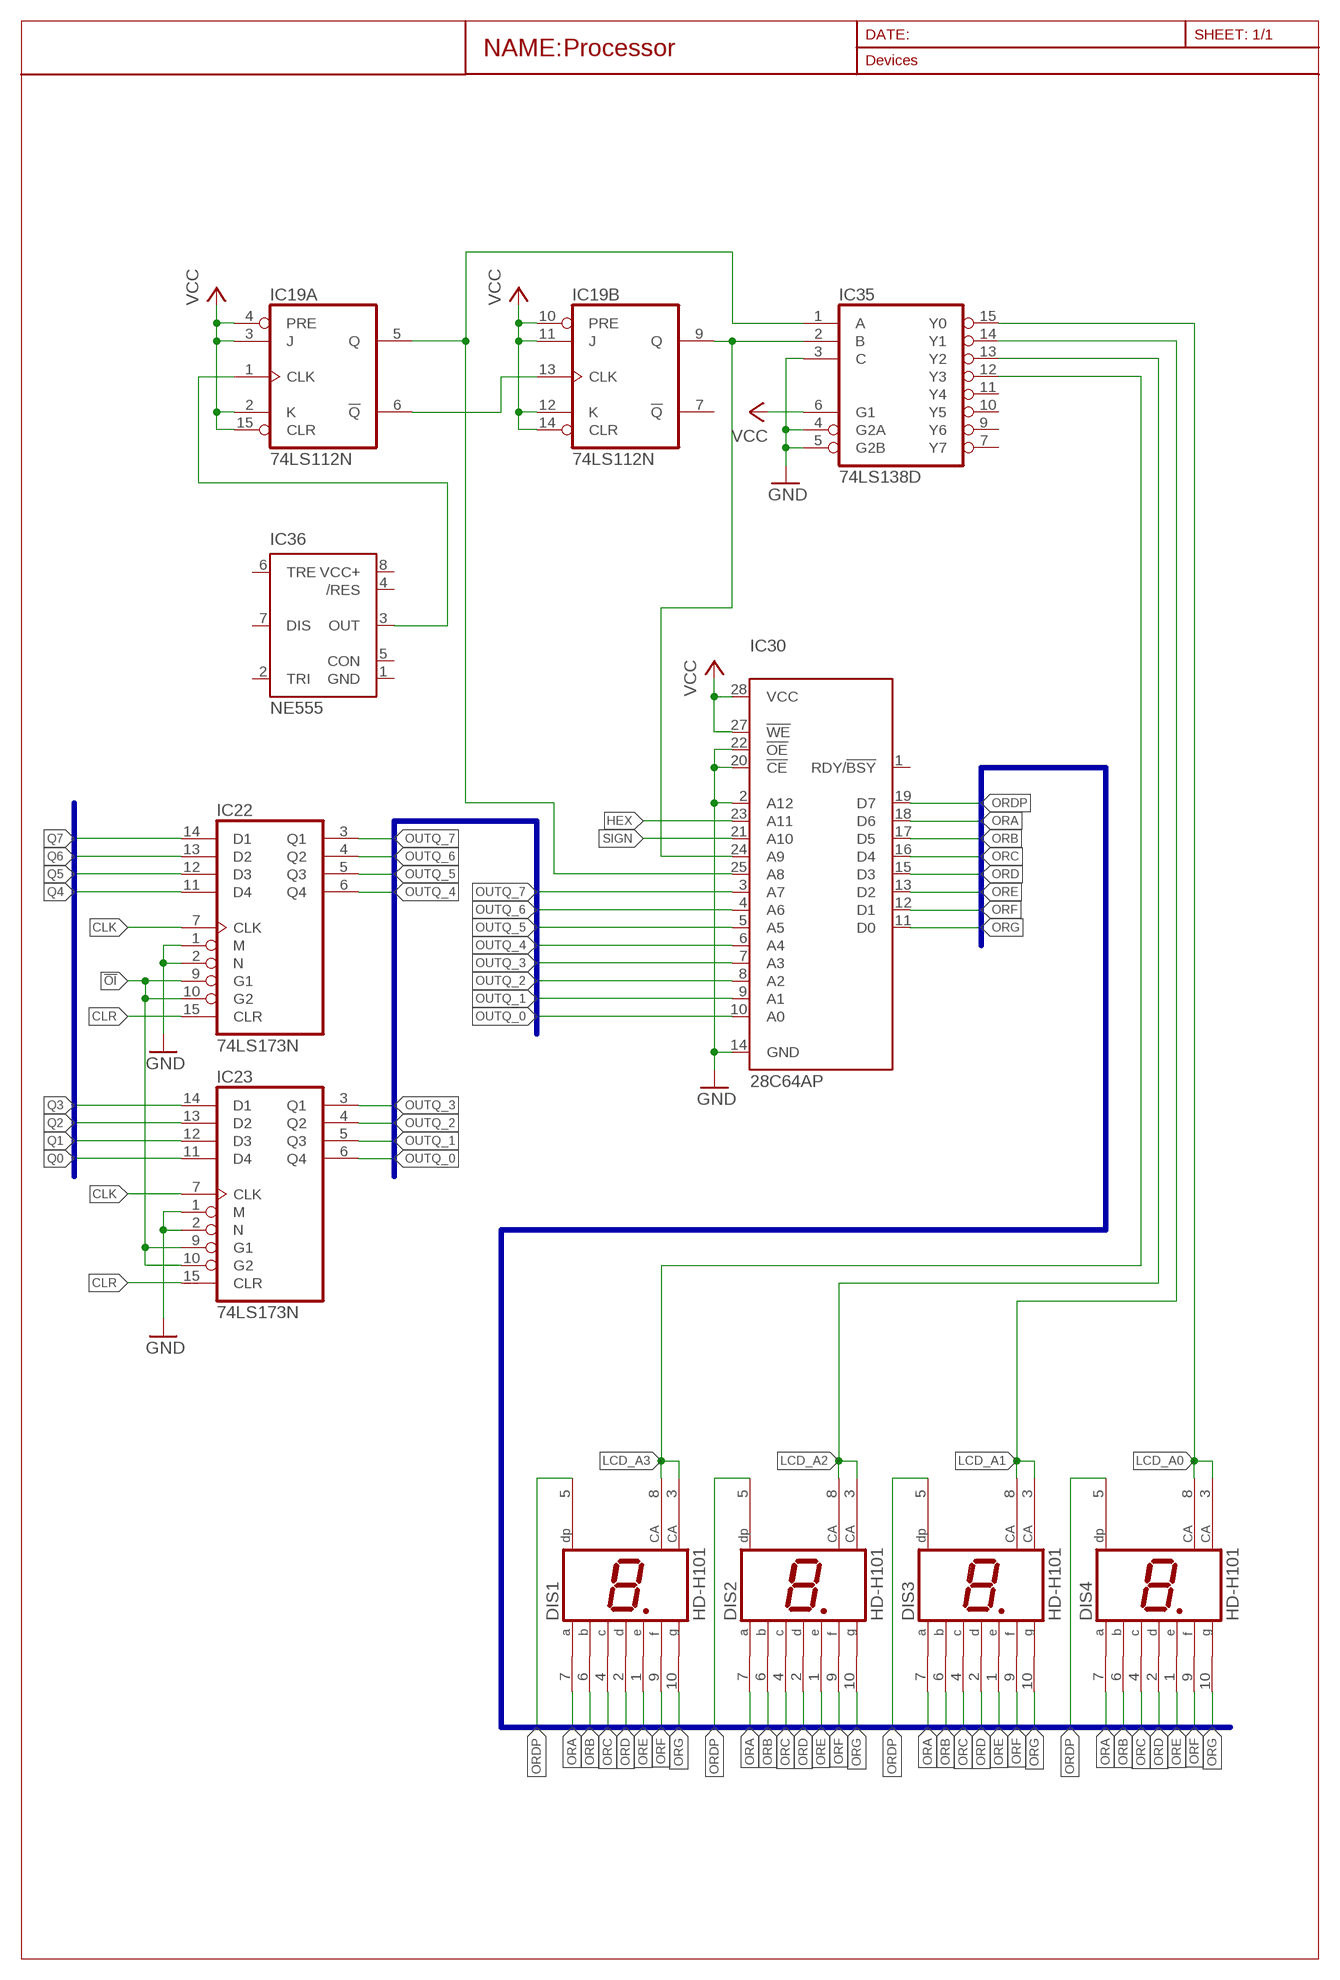
[diagram p4: schematic, module REGISTER_OUT, sheet 1]

### Parts
DIS1  HD-H101  [HDSP-M]
DIS2  HD-H101  [HDSP-M]
DIS3  HD-H101  [HDSP-M]
DIS4  HD-H101  [HDSP-M]
IC19  74LS112N  [DIL16]
IC22  74LS173N  [DIL16]
IC23  74LS173N  [DIL16]
IC30  28C64AP  [DIL28-6]
IC35  74LS138D  [SO16]
IC36  NE555  [DIL-08]

### Nets
!OI: IC22.9(G1) IC22.10(G2) IC23.9(G1) IC23.10(G2)
CLK: IC22.7(CLK) IC23.7(CLK)
CLR: IC22.15(CLR) IC23.15(CLR)
GND: IC22.1(M) IC22.2(N) IC23.1(M) IC23.2(N) IC30.2(A12) IC30.14(GND) IC30.20(!CE) IC30.22(!OE) IC35.3(C) IC35.4(G2A) IC35.5(G2B)
HEX: IC30.23(A11)
LCD_A0: DIS4.3(CA) DIS4.8(CA) IC35.15(Y0)
LCD_A1: DIS3.3(CA) DIS3.8(CA) IC35.14(Y1)
LCD_A2: DIS2.3(CA) DIS2.8(CA) IC35.13(Y2)
LCD_A3: DIS1.3(CA) DIS1.8(CA) IC35.12(Y3)
LCD_CLK: IC19.1(A:CLK) IC36.3(OUT)
N$27: IC19.6(A:!Q) IC19.13(B:CLK)
N$28: IC19.9(B:Q) IC30.24(A9) IC35.2(B)
N$51: IC19.5(A:Q) IC30.25(A8) IC35.1(A)
ORA: DIS1.7(A) DIS2.7(A) DIS3.7(A) DIS4.7(A) IC30.18(D6)
ORB: DIS1.6(B) DIS2.6(B) DIS3.6(B) DIS4.6(B) IC30.17(D5)
ORC: DIS1.4(C) DIS2.4(C) DIS3.4(C) DIS4.4(C) IC30.16(D4)
ORD: DIS1.2(D) DIS2.2(D) DIS3.2(D) DIS4.2(D) IC30.15(D3)
ORDP: DIS1.5(DP) DIS2.5(DP) DIS3.5(DP) DIS4.5(DP) IC30.19(D7)
ORE: DIS1.1(E) DIS2.1(E) DIS3.1(E) DIS4.1(E) IC30.13(D2)
ORF: DIS1.9(F) DIS2.9(F) DIS3.9(F) DIS4.9(F) IC30.12(D1)
ORG: DIS1.10(G) DIS2.10(G) DIS3.10(G) DIS4.10(G) IC30.11(D0)
OUTQ_0: IC23.6(Q4) IC30.10(A0)
OUTQ_1: IC23.5(Q3) IC30.9(A1)
OUTQ_2: IC23.4(Q2) IC30.8(A2)
OUTQ_3: IC23.3(Q1) IC30.7(A3)
OUTQ_4: IC22.6(Q4) IC30.6(A4)
OUTQ_5: IC22.5(Q3) IC30.5(A5)
OUTQ_6: IC22.4(Q2) IC30.4(A6)
OUTQ_7: IC22.3(Q1) IC30.3(A7)
Q0: IC23.11(D4)
Q1: IC23.12(D3)
Q2: IC23.13(D2)
Q3: IC23.14(D1)
Q4: IC22.11(D4)
Q5: IC22.12(D3)
Q6: IC22.13(D2)
Q7: IC22.14(D1)
SIGN: IC30.21(A10)
VCC: IC19.2(A:K) IC19.3(A:J) IC19.4(A:PRE) IC19.10(B:PRE) IC19.11(B:J) IC19.12(B:K) IC19.14(B:CLR) IC19.15(A:CLR) IC30.27(!WE) IC30.28(VCC) IC35.6(G1)
Unconnected: IC19.7(B:!Q) IC30.1(RDY/!BSY) IC35.7(Y7) IC35.9(Y6) IC35.10(Y5) IC35.11(Y4) IC36.2(TRI) IC36.4(/RES) IC36.5(CON) IC36.6(TRE) IC36.7(DIS)

### Buses
Q0,Q1,Q2,Q3,Q4,Q5,Q6,Q7
ORA,ORB,ORC,ORD,ORDP,ORE,ORF,ORG
OUTQ_0,OUTQ_1,OUTQ_2,OUTQ_3,OUTQ_4,OUTQ_5,OUTQ_6,OUTQ_7

### Power pins joined to a net without a drawn wire
GND: IC19.8(P:GND) IC22.8(GND) IC23.8(GND) IC35.8(GND) IC36.1(GND)
VCC: IC19.16(P:VCC) IC22.16(VCC) IC23.16(VCC) IC35.16(VCC)
VCC+: IC36.8(VCC+)

### Library data of the parts
DIS1-DIS4 = display-hp:HD-H101: LED DISPLAY 1-character 7 segment, decimal point right; OC_FARNELL: unknown; OC_NEWARK: unknown
IC19 = 74xx-eu:74*112: Dual J-K negative edge triggered FLIP FLOP, preset and clear
IC22 IC23 = 74xx-eu:74*173: 4-bit D type REGISTER, 3-state
IC30 = microchip:28*64A: CMOS EEPROM 64 K (8 K x 8), low voltage; MPN: AT28C64B-15PU; OC_FARNELL: 1631144; OC_NEWARK: 96K6557
IC35 = 74xx-eu:74*138: 3-line to 8-line DECODER/DEMULTIPLEXER
IC36 = st-microelectronics:NE555: General purpose bipolar Timer; MF: Arrow Electronics; MPN: NE555N; OC_FARNELL: 1467742; OC_NEWARK: 89K1486

## Module PC
Ports: VCC(pwr) GND(pwr) Q0(io) Q1(io) Q2(io) Q3(io) Q4(io) Q5(io) Q6(io) Q7(io) CLK(in) !CLR(in) !CI(in) !CO(in) CE(in)
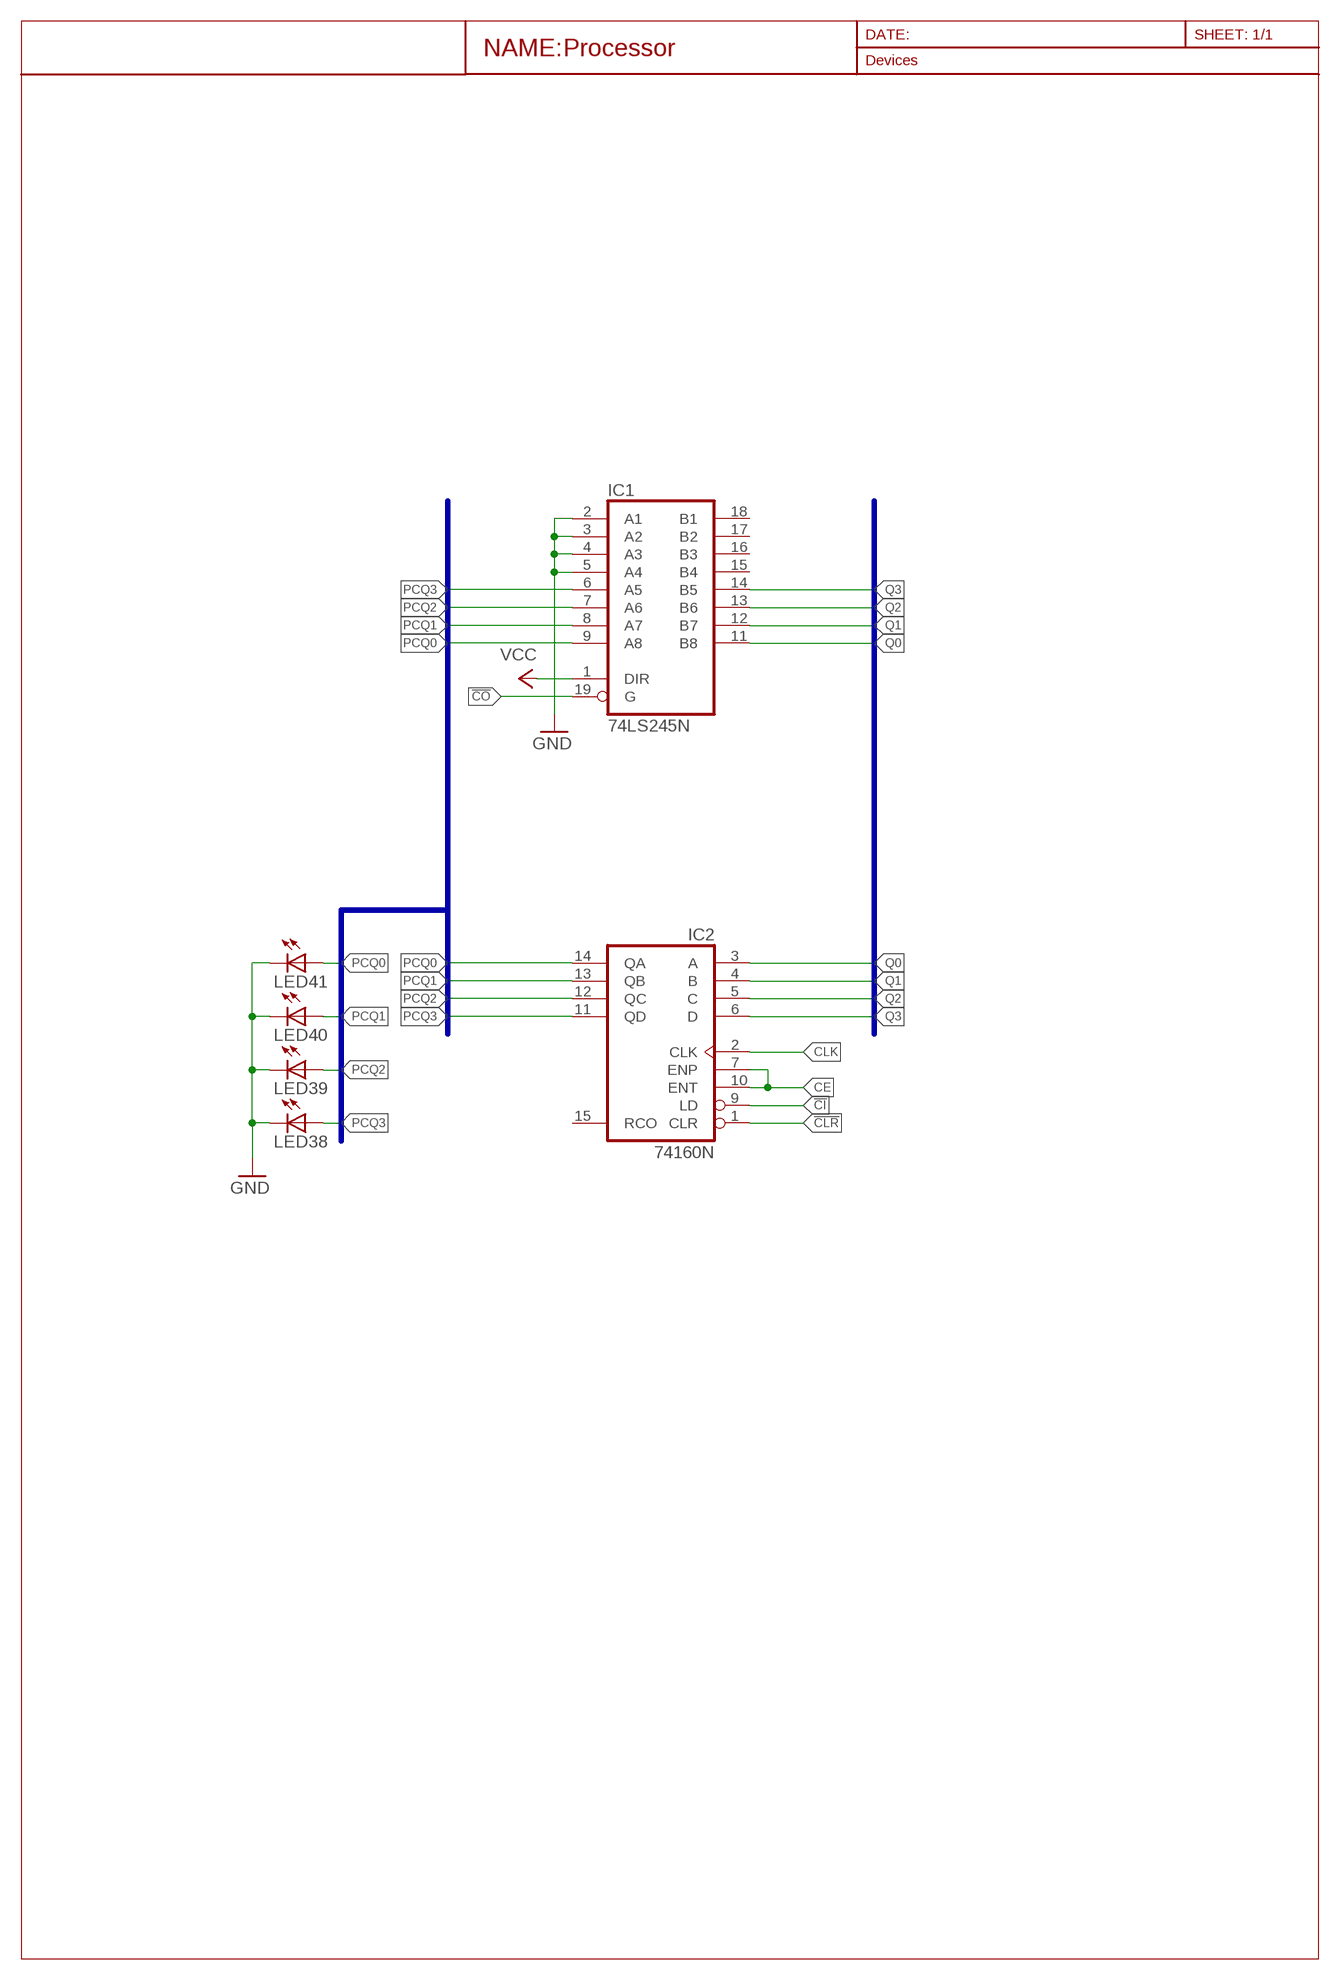
[diagram p5: schematic, module PC, sheet 1]

### Parts
IC1  74LS245N  [DIL20]
IC2  74160N  [DIL16]
LED38  LED5MM  [LED5MM]
LED39  LED5MM  [LED5MM]
LED40  LED5MM  [LED5MM]
LED41  LED5MM  [LED5MM]

### Nets
!CI: IC2.9(LD)
!CLR: IC2.1(CLR)
!CO: IC1.19(G)
CE: IC2.7(ENP) IC2.10(ENT)
CLK: IC2.2(CLK)
GND: IC1.2(A1) IC1.3(A2) IC1.4(A3) IC1.5(A4) LED38.K(C) LED39.K(C) LED40.K(C) LED41.K(C)
PCQ0: IC1.9(A8) IC2.14(QA) LED41.A
PCQ1: IC1.8(A7) IC2.13(QB) LED40.A
PCQ2: IC1.7(A6) IC2.12(QC) LED39.A
PCQ3: IC1.6(A5) IC2.11(QD) LED38.A
Q0: IC1.11(B8) IC2.3(A)
Q1: IC1.12(B7) IC2.4(B)
Q2: IC1.13(B6) IC2.5(C)
Q3: IC1.14(B5) IC2.6(D)
VCC: IC1.1(DIR)
Unconnected: IC1.15(B4) IC1.16(B3) IC1.17(B2) IC1.18(B1) IC2.15(RCO)

### Buses
DATA&ADDRESS:Q0,Q1,Q2,Q3,Q4,Q5,Q6,Q7
PCQ0,PCQ1,PCQ2,PCQ3,PCQ4,PCQ5,PCQ6,PCQ7

### Power pins joined to a net without a drawn wire
GND: IC1.10(GND) IC2.8(GND)
VCC: IC1.20(VCC) IC2.16(VCC)

### Library data of the parts
IC1 = 74xx-eu:74*245: Octal BUS TRANSCEIVER, 3-state
IC2 = 74xx-eu:74*160: Synchronous 4-bit COUNTER
LED38-LED41 = led:LED: LED OSRAM: - CHIPLED LG R971, LG N971, LY N971, LG Q971, LY Q971, LO R971, LY R971 LH N974, LH R974 LS Q976, LO Q976, LY Q976 LO Q996 - Hyper CHIPLED LW Q18S LB Q993, LB Q99A, LB R99A - SideLED LS A670, LO A670, LY A670, LG A670, LP A670 LB A673, LV A673, LT A673, LW A673 LH A674 LY A675 LS A676, LA A676, LO A676, LY A676, LW A676 LS A679, LY A679, LG A679 - Hyper Micro SIDELED® LS Y876, LA Y876, LO Y876, LY Y876 LT Y87S - SmartLED LW L88C, LW L88S LB L89C, LB L89S, LG L890 LS L89K, LO L89K, LY L89K LS L896, LA L896, LO L896, LY L896 - TOPLED LS T670, LO T670, LY T670, LG T670, LP T670 LSG T670, LSP T670, LSY T670, LOP T670, LYG T670 LG T671, LOG T671, LSG T671 LB T673, LV T673, LT T673, LW T673 LH T674 LS T676, LA T676, LO T676, LY T676, LB T676, LH T676, LSB T676, LW T676 LB T67C, LV T67C, LT T67C, LS T67K, LO T67K, LY T67K, LW E67C LS E67B, LA E67B, LO E67B, LY E67B, LB E67C, LV E67C, LT E67C LW T67C LS T679, LY T679, LG T679 LS T770, LO T770, LY T770, LG T770, LP T770 LB T773, LV T773, LT T773, LW T773 LH T774 LS E675, LA E675, LY E675, LS T675 LS T776, LA T776, LO T776, LY T776, LB T776 LHGB T686 LT T68C, LB T68C - Hyper Mini TOPLED® LB M676 - Mini TOPLED Santana® LG M470 LS M47K, LO M47K, LY M47K Source: http://www.osram.convergy.de LUXEON: - LUMILED® LXK2-PW12-R00, LXK2-PW12-S00, LXK2-PW14-U00, LXK2-PW14-V00 LXK2-PM12-R00, LXK2-PM12-S00, LXK2-PM14-U00 LXK2-PE12-Q00, LXK2-PE12-R00, LXK2-PE12-S00, LXK2-PE14-T00, LXK2-PE14-U00 LXK2-PB12-K00, LXK2-PB12-L00, LXK2-PB12-M00, LXK2-PB14-N00, LXK2-PB14-P00, LXK2-PB14-Q00 LXK2-PR12-L00, LXK2-PR12-M00, LXK2-PR14-Q00, LXK2-PR14-R00 LXK2-PD12-Q00, LXK2-PD12-R00, LXK2-PD12-S00 LXK2-PH12-R00, LXK2-PH12-S00 LXK2-PL12-P00, LXK2-PL12-Q00, LXK2-PL12-R00 Source: www.luxeon.com KINGBRIGHT: KA-3528ASYC Source: www.kingbright.com

## Module CLOCK
Ports: VCC(pwr) GND(pwr) CLK(out) !HLT(in)
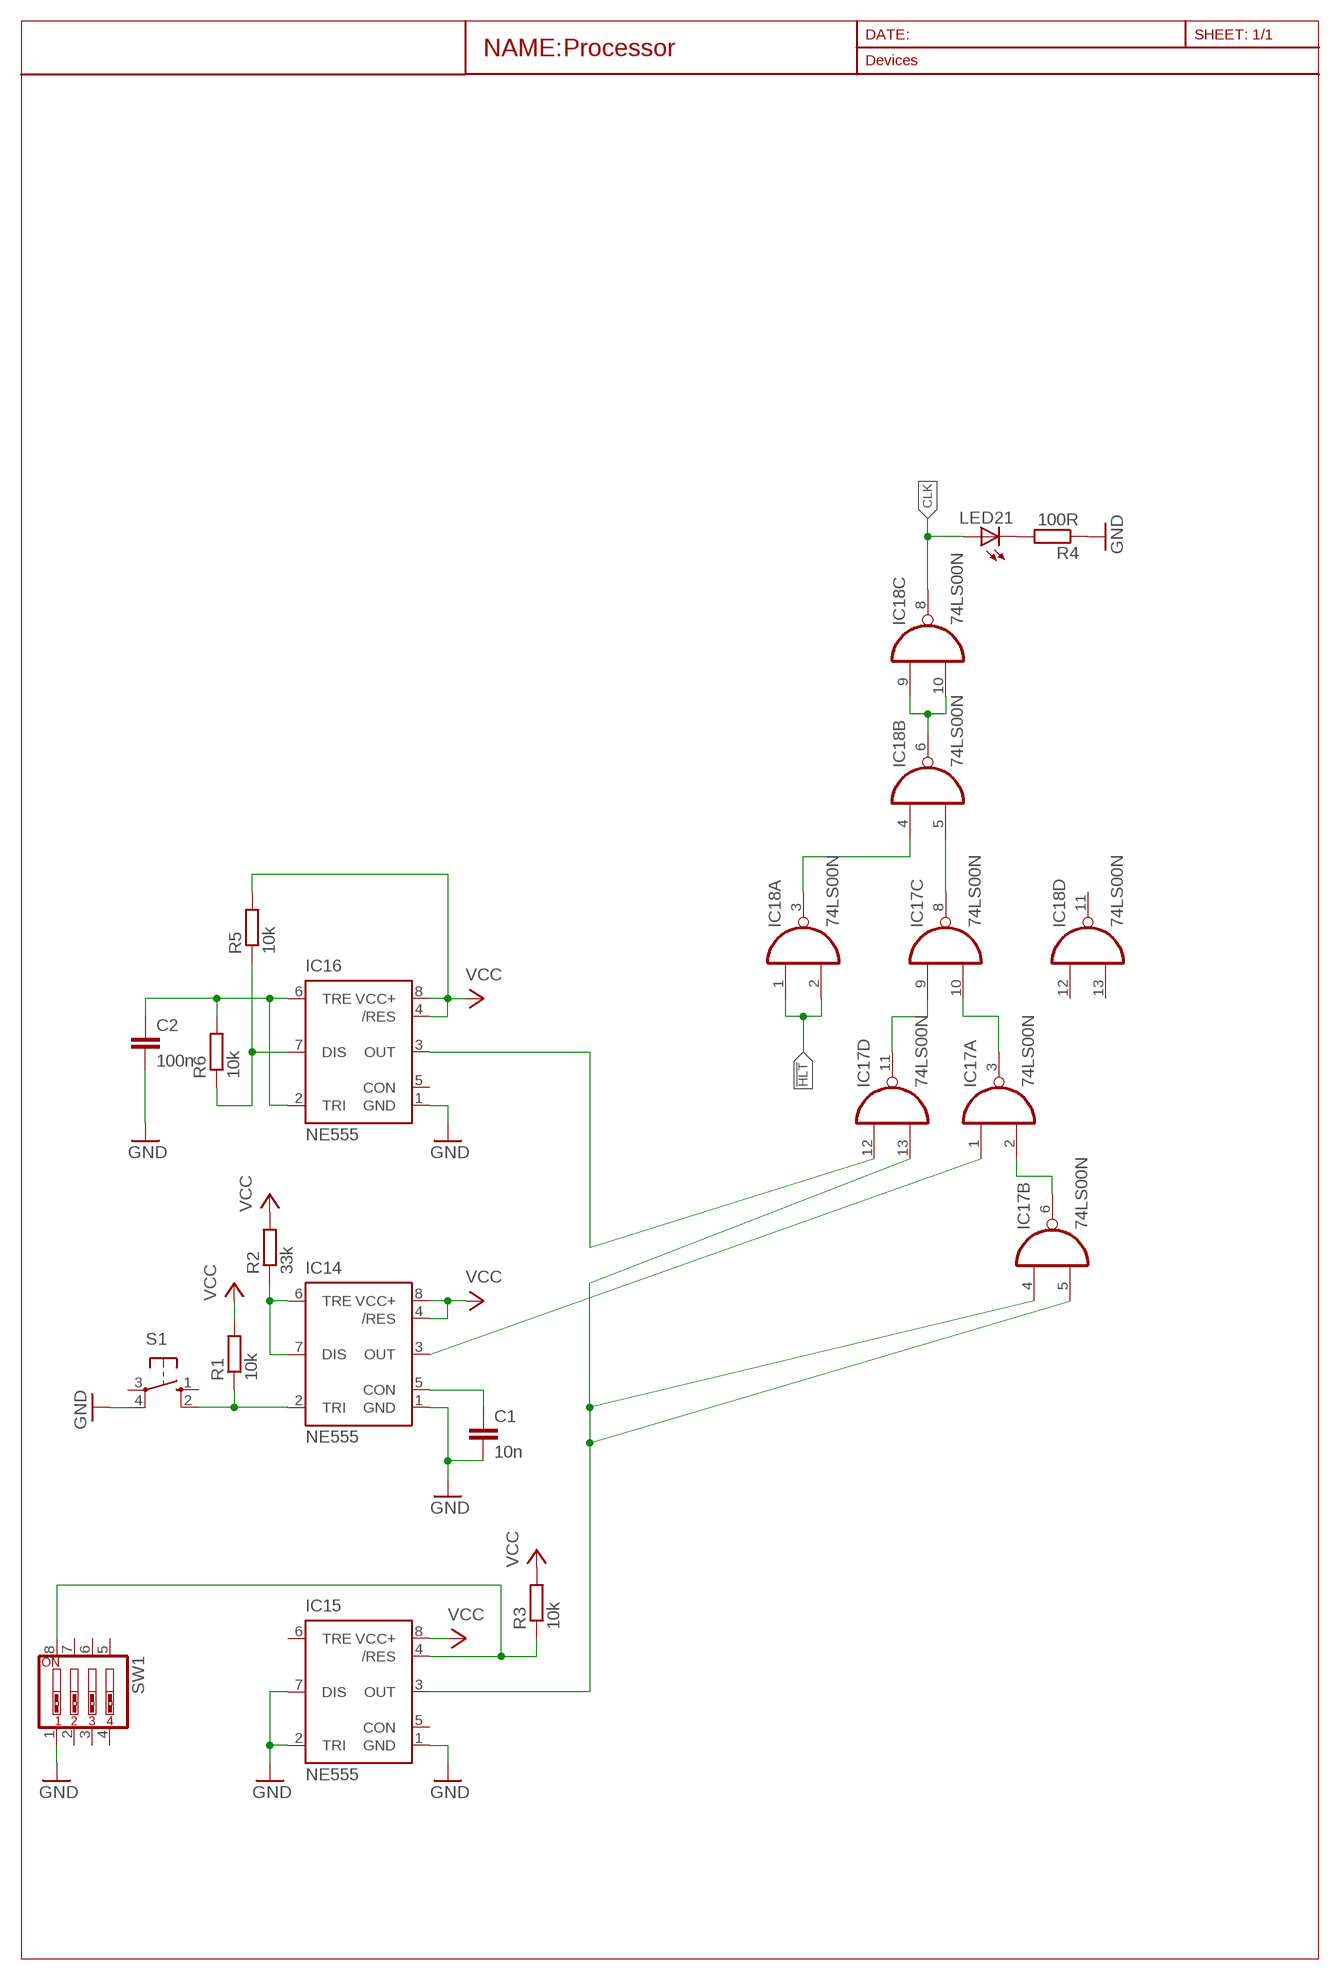
[diagram p6: schematic, module CLOCK, sheet 1]

### Parts
C1  10n  C-EU050-024X044  [C050-024X044]
C2  100n  C-EU050-024X044  [C050-024X044]
IC14  NE555  [DIL-08]
IC15  NE555  [DIL-08]
IC16  NE555  [DIL-08]
IC17  74LS00N  [DIL14]
IC18  74LS00N  [DIL14]
LED21  LED5MM  [LED5MM]
R1  10k  R-EU_0207/10  [0207/10]
R2  33k  R-EU_0207/10  [0207/10]
R3  10k  R-EU_0207/10  [0207/10]
R4  100R  R-EU_0207/10  [0207/10]
R5  10k  R-EU_0207/10  [0207/10]
R6  10k  R-EU_0207/10  [0207/10]
S1  10-XX  [B3F-10XX]
SW1  SW_DIP-4  [EDG-04]

### Nets
!HLT: IC18.1(A:I0) IC18.2(A:I1)
CLK: IC18.8(C:O) LED21.A
GND: C1.2 C2.2 IC14.1(GND) IC15.1(GND) IC15.2(TRI) IC15.7(DIS) IC16.1(GND) R4.1 S1.4(P1) SW1.1
N$1: IC14.6(TRE) IC14.7(DIS) R2.1
N$2: IC14.2(TRI) R1.1 S1.2(S1)
N$3: C1.1 IC14.5(CON)
N$4: IC14.3(OUT) IC17.1(A:I0)
N$6: IC17.2(A:I1) IC17.6(B:O)
N$7: IC15.3(OUT) IC17.4(B:I0) IC17.5(B:I1) IC17.13(D:I1)
N$8: IC15.4(/RES) R3.1 SW1.8
N$9: IC17.3(A:O) IC17.10(C:I1)
N$10: IC17.9(C:I0) IC17.11(D:O)
N$11: IC16.3(OUT) IC17.12(D:I0)
N$12: IC17.8(C:O) IC18.5(B:I1)
N$13: IC18.3(A:O) IC18.4(B:I0)
N$14: IC18.6(B:O) IC18.9(C:I0) IC18.10(C:I1)
N$15: LED21.K(C) R4.2
N$16: C2.1 IC16.2(TRI) IC16.6(TRE) R6.2
N$17: IC16.7(DIS) R5.1 R6.1
VCC: IC14.4(/RES) IC14.8(VCC+) IC15.8(VCC+) IC16.4(/RES) IC16.8(VCC+) R1.2 R2.2 R3.2 R5.2
Unconnected: IC15.5(CON) IC15.6(TRE) IC16.5(CON) IC18.11(D:O) IC18.12(D:I0) IC18.13(D:I1) S1.1(S) S1.3(P) SW1.2 SW1.3 SW1.4 SW1.5 SW1.6 SW1.7

### Power pins joined to a net without a drawn wire
GND: IC17.7(P:GND) IC18.7(P:GND)
VCC: IC17.14(P:VCC) IC18.14(P:VCC)

### Library data of the parts
C1 C2 = rcl:C-EU: CAPACITOR, European symbol; SPICEPREFIX: C
IC14-IC16 = st-microelectronics:NE555: General purpose bipolar Timer; MF: Arrow Electronics; MPN: NE555N; OC_FARNELL: 1467742; OC_NEWARK: 89K1486
IC17 IC18 = 74xx-eu:74*00: Quad 2-input NAND gate
LED21 = led:LED: LED OSRAM: - CHIPLED LG R971, LG N971, LY N971, LG Q971, LY Q971, LO R971, LY R971 LH N974, LH R974 LS Q976, LO Q976, LY Q976 LO Q996 - Hyper CHIPLED LW Q18S LB Q993, LB Q99A, LB R99A - SideLED LS A670, LO A670, LY A670, LG A670, LP A670 LB A673, LV A673, LT A673, LW A673 LH A674 LY A675 LS A676, LA A676, LO A676, LY A676, LW A676 LS A679, LY A679, LG A679 - Hyper Micro SIDELED® LS Y876, LA Y876, LO Y876, LY Y876 LT Y87S - SmartLED LW L88C, LW L88S LB L89C, LB L89S, LG L890 LS L89K, LO L89K, LY L89K LS L896, LA L896, LO L896, LY L896 - TOPLED LS T670, LO T670, LY T670, LG T670, LP T670 LSG T670, LSP T670, LSY T670, LOP T670, LYG T670 LG T671, LOG T671, LSG T671 LB T673, LV T673, LT T673, LW T673 LH T674 LS T676, LA T676, LO T676, LY T676, LB T676, LH T676, LSB T676, LW T676 LB T67C, LV T67C, LT T67C, LS T67K, LO T67K, LY T67K, LW E67C LS E67B, LA E67B, LO E67B, LY E67B, LB E67C, LV E67C, LT E67C LW T67C LS T679, LY T679, LG T679 LS T770, LO T770, LY T770, LG T770, LP T770 LB T773, LV T773, LT T773, LW T773 LH T774 LS E675, LA E675, LY E675, LS T675 LS T776, LA T776, LO T776, LY T776, LB T776 LHGB T686 LT T68C, LB T68C - Hyper Mini TOPLED® LB M676 - Mini TOPLED Santana® LG M470 LS M47K, LO M47K, LY M47K Source: http://www.osram.convergy.de LUXEON: - LUMILED® LXK2-PW12-R00, LXK2-PW12-S00, LXK2-PW14-U00, LXK2-PW14-V00 LXK2-PM12-R00, LXK2-PM12-S00, LXK2-PM14-U00 LXK2-PE12-Q00, LXK2-PE12-R00, LXK2-PE12-S00, LXK2-PE14-T00, LXK2-PE14-U00 LXK2-PB12-K00, LXK2-PB12-L00, LXK2-PB12-M00, LXK2-PB14-N00, LXK2-PB14-P00, LXK2-PB14-Q00 LXK2-PR12-L00, LXK2-PR12-M00, LXK2-PR14-Q00, LXK2-PR14-R00 LXK2-PD12-Q00, LXK2-PD12-R00, LXK2-PD12-S00 LXK2-PH12-R00, LXK2-PH12-S00 LXK2-PL12-P00, LXK2-PL12-Q00, LXK2-PL12-R00 Source: www.luxeon.com KINGBRIGHT: KA-3528ASYC Source: www.kingbright.com
R1-R6 = rcl:R-EU_: RESISTOR, European symbol; SPICEPREFIX: R
S1 = switch-omron:10-XX: OMRON SWITCH; MPN: B3F-1000; OC_FARNELL: 176432; OC_NEWARK: 36M3542
SW1 = special:SW_DIP-4: DIP SWITCH

## Module REGISTER_MA
Ports: VCC(pwr) GND(pwr) Q0(in) Q1(in) Q2(in) Q3(in) Q4(in) Q5(in) Q6(in) Q7(in) MAQ0(out) MAQ1(out) MAQ2(out) MAQ3(out) MAQ4(nc) MAQ5(nc) MAQ6(nc) MAQ7(nc) CLK(in) CLR(in) !MI(in) MAR_!G(in)
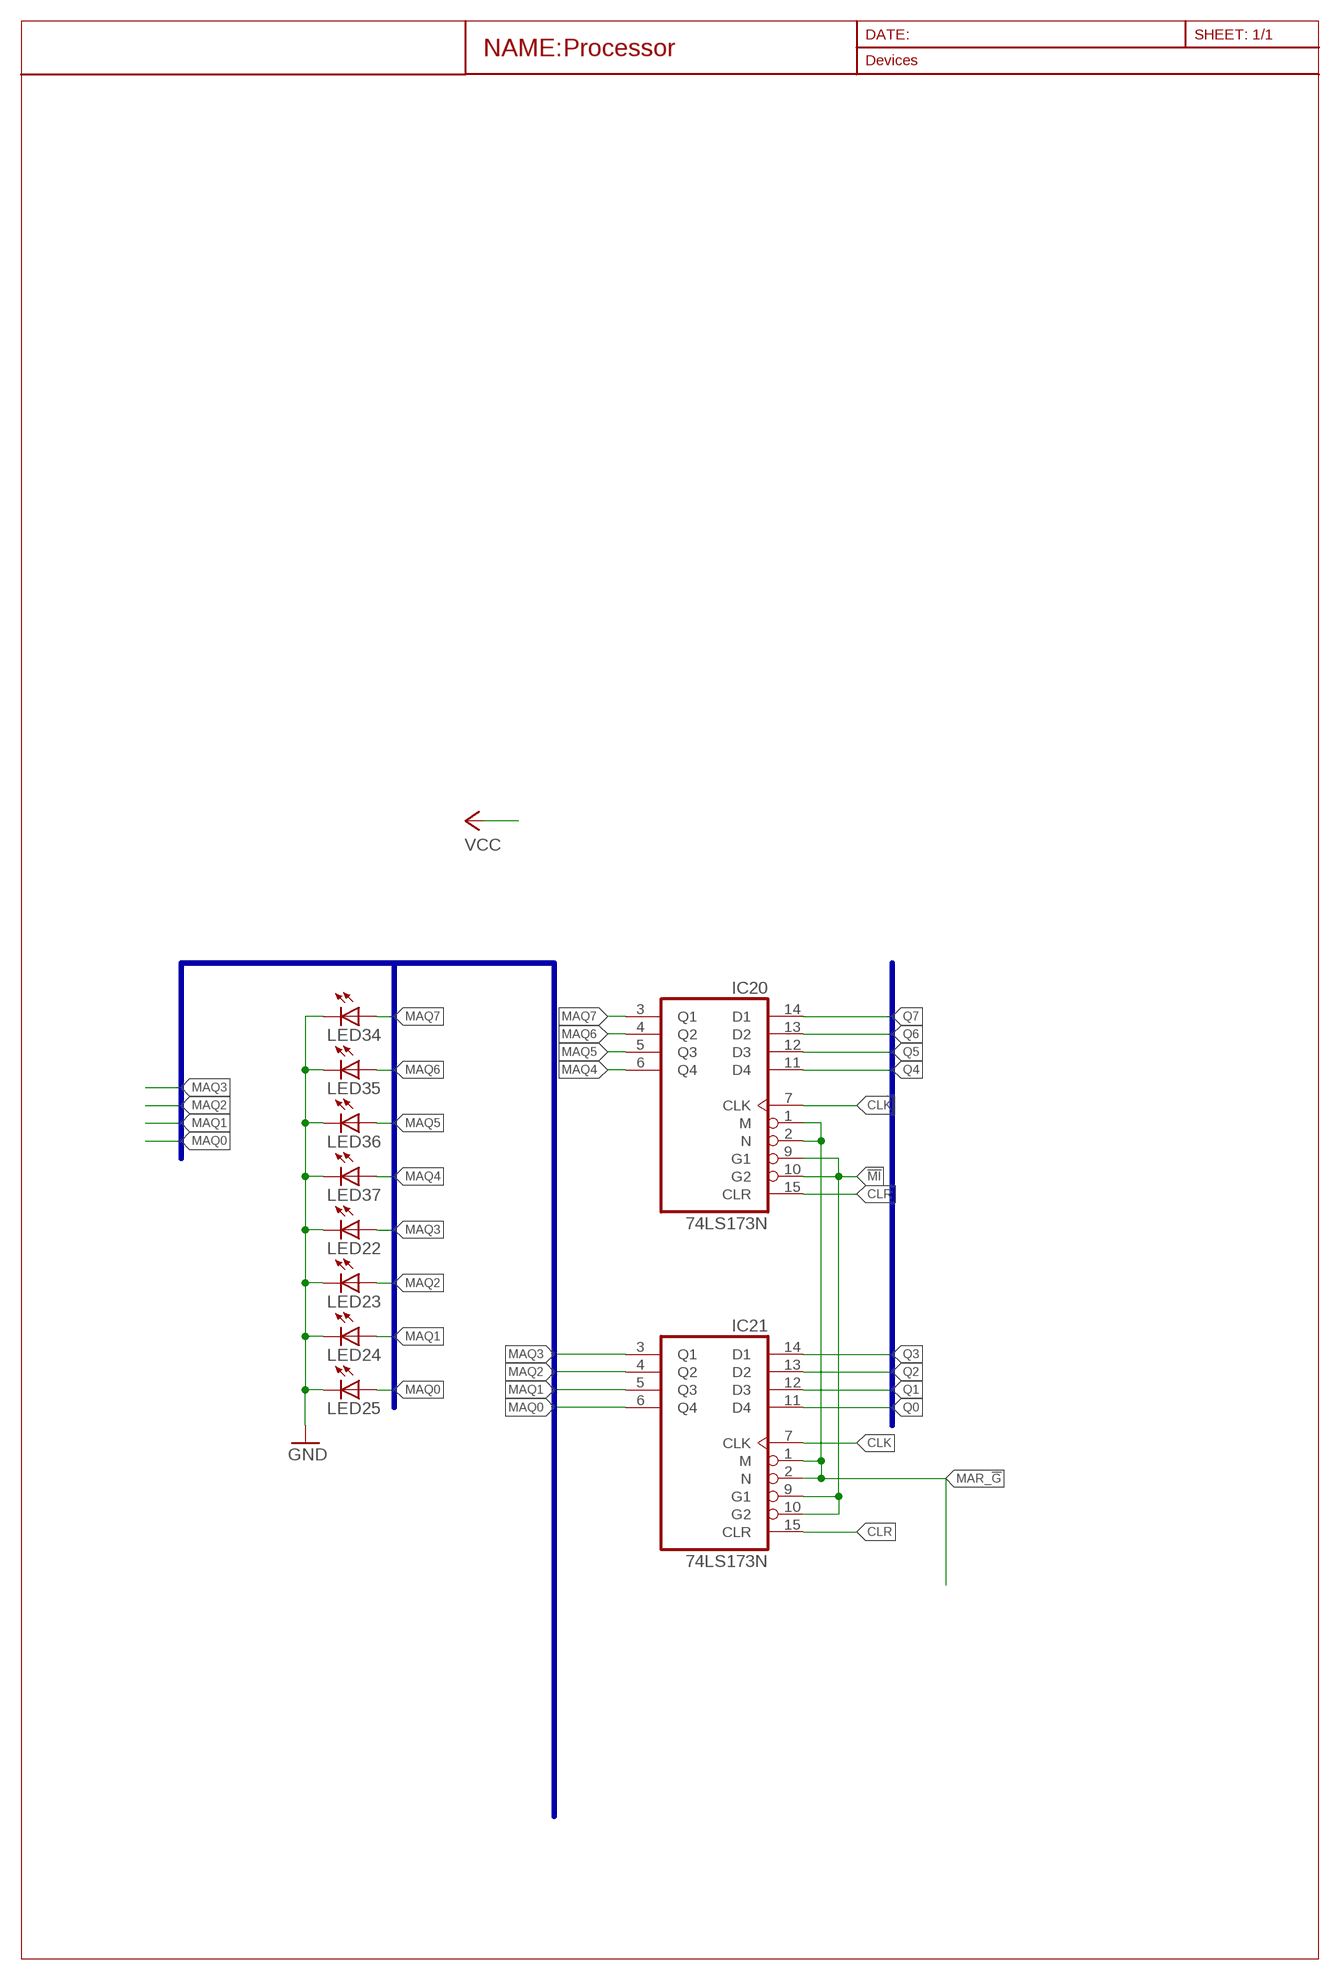
[diagram p7: schematic, module REGISTER_MA, sheet 1]

### Parts
IC20  74LS173N  [DIL16]
IC21  74LS173N  [DIL16]
LED22  LED5MM  [LED5MM]
LED23  LED5MM  [LED5MM]
LED24  LED5MM  [LED5MM]
LED25  LED5MM  [LED5MM]
LED34  LED5MM  [LED5MM]
LED35  LED5MM  [LED5MM]
LED36  LED5MM  [LED5MM]
LED37  LED5MM  [LED5MM]

### Nets
!MI: IC20.9(G1) IC20.10(G2) IC21.9(G1) IC21.10(G2)
CLK: IC20.7(CLK) IC21.7(CLK)
CLR: IC20.15(CLR) IC21.15(CLR)
GND: LED22.K(C) LED23.K(C) LED24.K(C) LED25.K(C) LED34.K(C) LED35.K(C) LED36.K(C) LED37.K(C)
MAQ0: IC21.6(Q4) LED25.A
MAQ1: IC21.5(Q3) LED24.A
MAQ2: IC21.4(Q2) LED23.A
MAQ3: IC21.3(Q1) LED22.A
MAQ4: IC20.6(Q4) LED37.A
MAQ5: IC20.5(Q3) LED36.A
MAQ6: IC20.4(Q2) LED35.A
MAQ7: IC20.3(Q1) LED34.A
MAR_!G: IC20.1(M) IC20.2(N) IC21.1(M) IC21.2(N)
Q0: IC21.11(D4)
Q1: IC21.12(D3)
Q2: IC21.13(D2)
Q3: IC21.14(D1)
Q4: IC20.11(D4)
Q5: IC20.12(D3)
Q6: IC20.13(D2)
Q7: IC20.14(D1)

### Buses
DATA&ADDRESS:Q0,Q1,Q2,Q3,Q4,Q5,Q6,Q7
MAQ0,MAQ1,MAQ2,MAQ3,MAQ4,MAQ5,MAQ6,MAQ7

### Power pins joined to a net without a drawn wire
GND: IC20.8(GND) IC21.8(GND)
VCC: IC20.16(VCC) IC21.16(VCC)

### Library data of the parts
IC20 IC21 = 74xx-eu:74*173: 4-bit D type REGISTER, 3-state
LED22-LED25 LED34-LED37 = led:LED: LED OSRAM: - CHIPLED LG R971, LG N971, LY N971, LG Q971, LY Q971, LO R971, LY R971 LH N974, LH R974 LS Q976, LO Q976, LY Q976 LO Q996 - Hyper CHIPLED LW Q18S LB Q993, LB Q99A, LB R99A - SideLED LS A670, LO A670, LY A670, LG A670, LP A670 LB A673, LV A673, LT A673, LW A673 LH A674 LY A675 LS A676, LA A676, LO A676, LY A676, LW A676 LS A679, LY A679, LG A679 - Hyper Micro SIDELED® LS Y876, LA Y876, LO Y876, LY Y876 LT Y87S - SmartLED LW L88C, LW L88S LB L89C, LB L89S, LG L890 LS L89K, LO L89K, LY L89K LS L896, LA L896, LO L896, LY L896 - TOPLED LS T670, LO T670, LY T670, LG T670, LP T670 LSG T670, LSP T670, LSY T670, LOP T670, LYG T670 LG T671, LOG T671, LSG T671 LB T673, LV T673, LT T673, LW T673 LH T674 LS T676, LA T676, LO T676, LY T676, LB T676, LH T676, LSB T676, LW T676 LB T67C, LV T67C, LT T67C, LS T67K, LO T67K, LY T67K, LW E67C LS E67B, LA E67B, LO E67B, LY E67B, LB E67C, LV E67C, LT E67C LW T67C LS T679, LY T679, LG T679 LS T770, LO T770, LY T770, LG T770, LP T770 LB T773, LV T773, LT T773, LW T773 LH T774 LS E675, LA E675, LY E675, LS T675 LS T776, LA T776, LO T776, LY T776, LB T776 LHGB T686 LT T68C, LB T68C - Hyper Mini TOPLED® LB M676 - Mini TOPLED Santana® LG M470 LS M47K, LO M47K, LY M47K Source: http://www.osram.convergy.de LUXEON: - LUMILED® LXK2-PW12-R00, LXK2-PW12-S00, LXK2-PW14-U00, LXK2-PW14-V00 LXK2-PM12-R00, LXK2-PM12-S00, LXK2-PM14-U00 LXK2-PE12-Q00, LXK2-PE12-R00, LXK2-PE12-S00, LXK2-PE14-T00, LXK2-PE14-U00 LXK2-PB12-K00, LXK2-PB12-L00, LXK2-PB12-M00, LXK2-PB14-N00, LXK2-PB14-P00, LXK2-PB14-Q00 LXK2-PR12-L00, LXK2-PR12-M00, LXK2-PR14-Q00, LXK2-PR14-R00 LXK2-PD12-Q00, LXK2-PD12-R00, LXK2-PD12-S00 LXK2-PH12-R00, LXK2-PH12-S00 LXK2-PL12-P00, LXK2-PL12-Q00, LXK2-PL12-R00 Source: www.luxeon.com KINGBRIGHT: KA-3528ASYC Source: www.kingbright.com

## Module RAM
Ports: VCC(pwr) GND(pwr) Q0(io) Q1(io) Q2(io) Q3(io) Q4(io) Q5(io) Q6(io) Q7(io) A0(in) A1(in) A2(in) A3(in) !OE(in) !WE(in) D7(in) D6(in) D5(in) D4(in) D3(in) D2(in) D1(in) D0(in) TRANS_!G(in) TRANS_DIR(in)
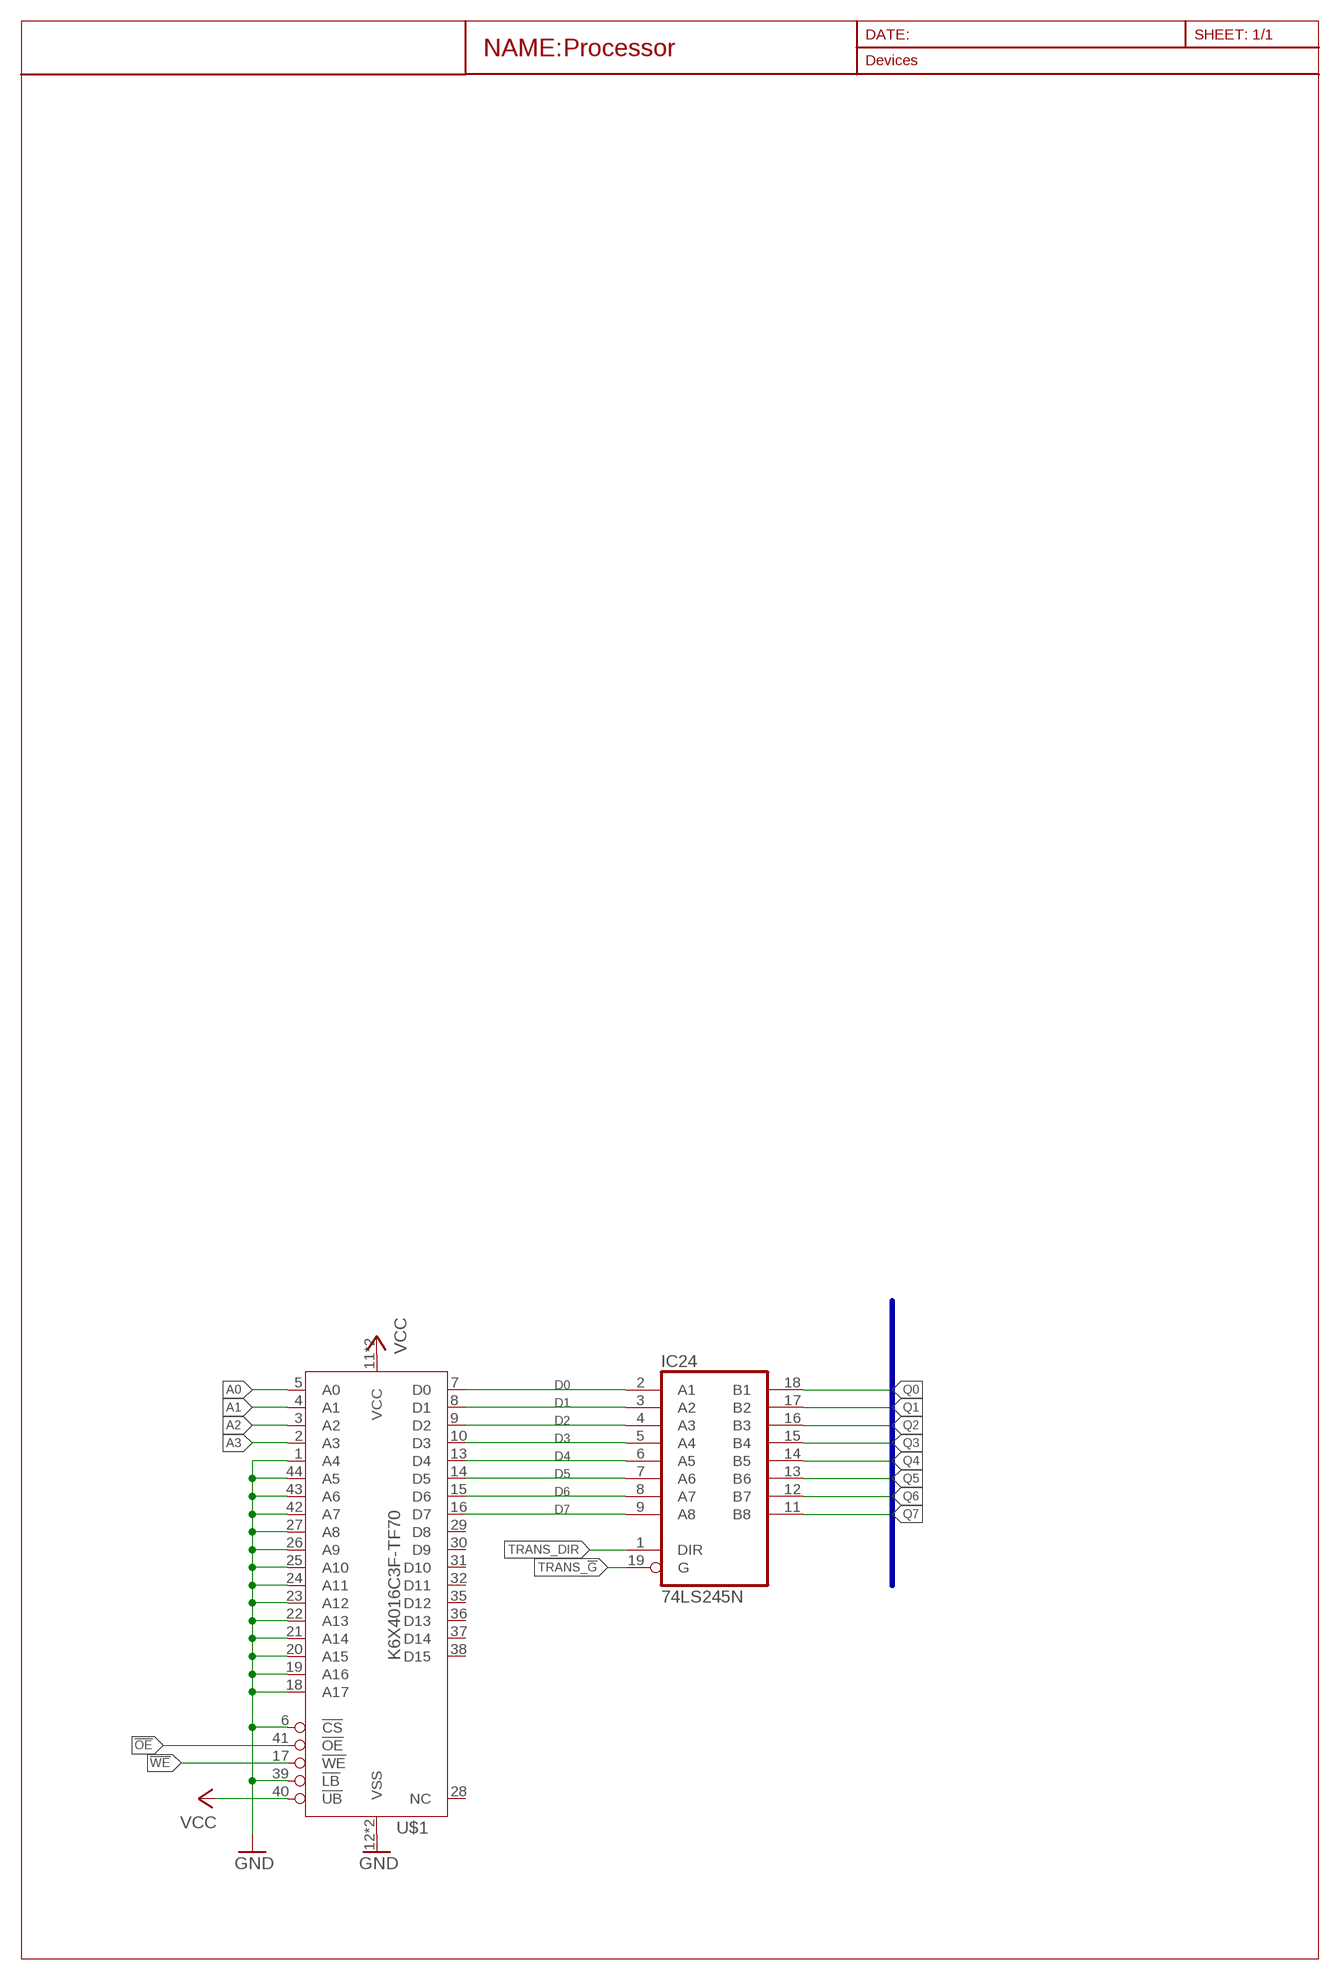
[diagram p8: schematic, module RAM, sheet 1]

### Parts
IC24  74LS245N  [DIL20]
U$1  K6X4016C3F-TF70  [TSOP44-II]

### Nets
!OE: U$1.41(!OE)
!WE: U$1.17(!WE)
A0: U$1.5(A0)
A1: U$1.4(A1)
A2: U$1.3(A2)
A3: U$1.2(A3)
D0: IC24.2(A1) U$1.7(D0)
D1: IC24.3(A2) U$1.8(D1)
D2: IC24.4(A3) U$1.9(D2)
D3: IC24.5(A4) U$1.10(D3)
D4: IC24.6(A5) U$1.13(D4)
D5: IC24.7(A6) U$1.14(D5)
D6: IC24.8(A7) U$1.15(D6)
D7: IC24.9(A8) U$1.16(D7)
GND: U$1.1(A4) U$1.6(!CS) U$1.12(VSS) U$1.18(A17) U$1.19(A16) U$1.20(A15) U$1.21(A14) U$1.22(A13) U$1.23(A12) U$1.24(A11) U$1.25(A10) U$1.26(A9) U$1.27(A8) U$1.34(VSS) U$1.39(!LB) U$1.42(A7) U$1.43(A6) U$1.44(A5)
Q0: IC24.18(B1)
Q1: IC24.17(B2)
Q2: IC24.16(B3)
Q3: IC24.15(B4)
Q4: IC24.14(B5)
Q5: IC24.13(B6)
Q6: IC24.12(B7)
Q7: IC24.11(B8)
TRANS_!G: IC24.19(G)
TRANS_DIR: IC24.1(DIR)
VCC: U$1.11(VCC) U$1.33(VCC) U$1.40(!UB)
Unconnected: U$1.28(NC) U$1.29(D8) U$1.30(D9) U$1.31(D10) U$1.32(D11) U$1.35(D12) U$1.36(D13) U$1.37(D14) U$1.38(D15)

### Buses
DATA&ADDRESS:Q0,Q1,Q2,Q3,Q4,Q5,Q6,Q7

### Power pins joined to a net without a drawn wire
GND: IC24.10(GND)
VCC: IC24.20(VCC)

### Library data of the parts
IC24 = 74xx-eu:74*245: Octal BUS TRANSCEIVER, 3-state
U$1 = sram:K6X4016C3F

## Module MEMCTRL
Ports: D0(out) D1(out) D2(out) D3(out) D4(out) D5(out) D6(out) D7(out) A3(out) A2(out) A1(out) A0(out) MAR_!G(out) TRANS_DIR(out) TRANS_!G(out) !WE(out) !OE(out) VCC(pwr) GND(pwr) CLK(in) RI(in) RO(in)
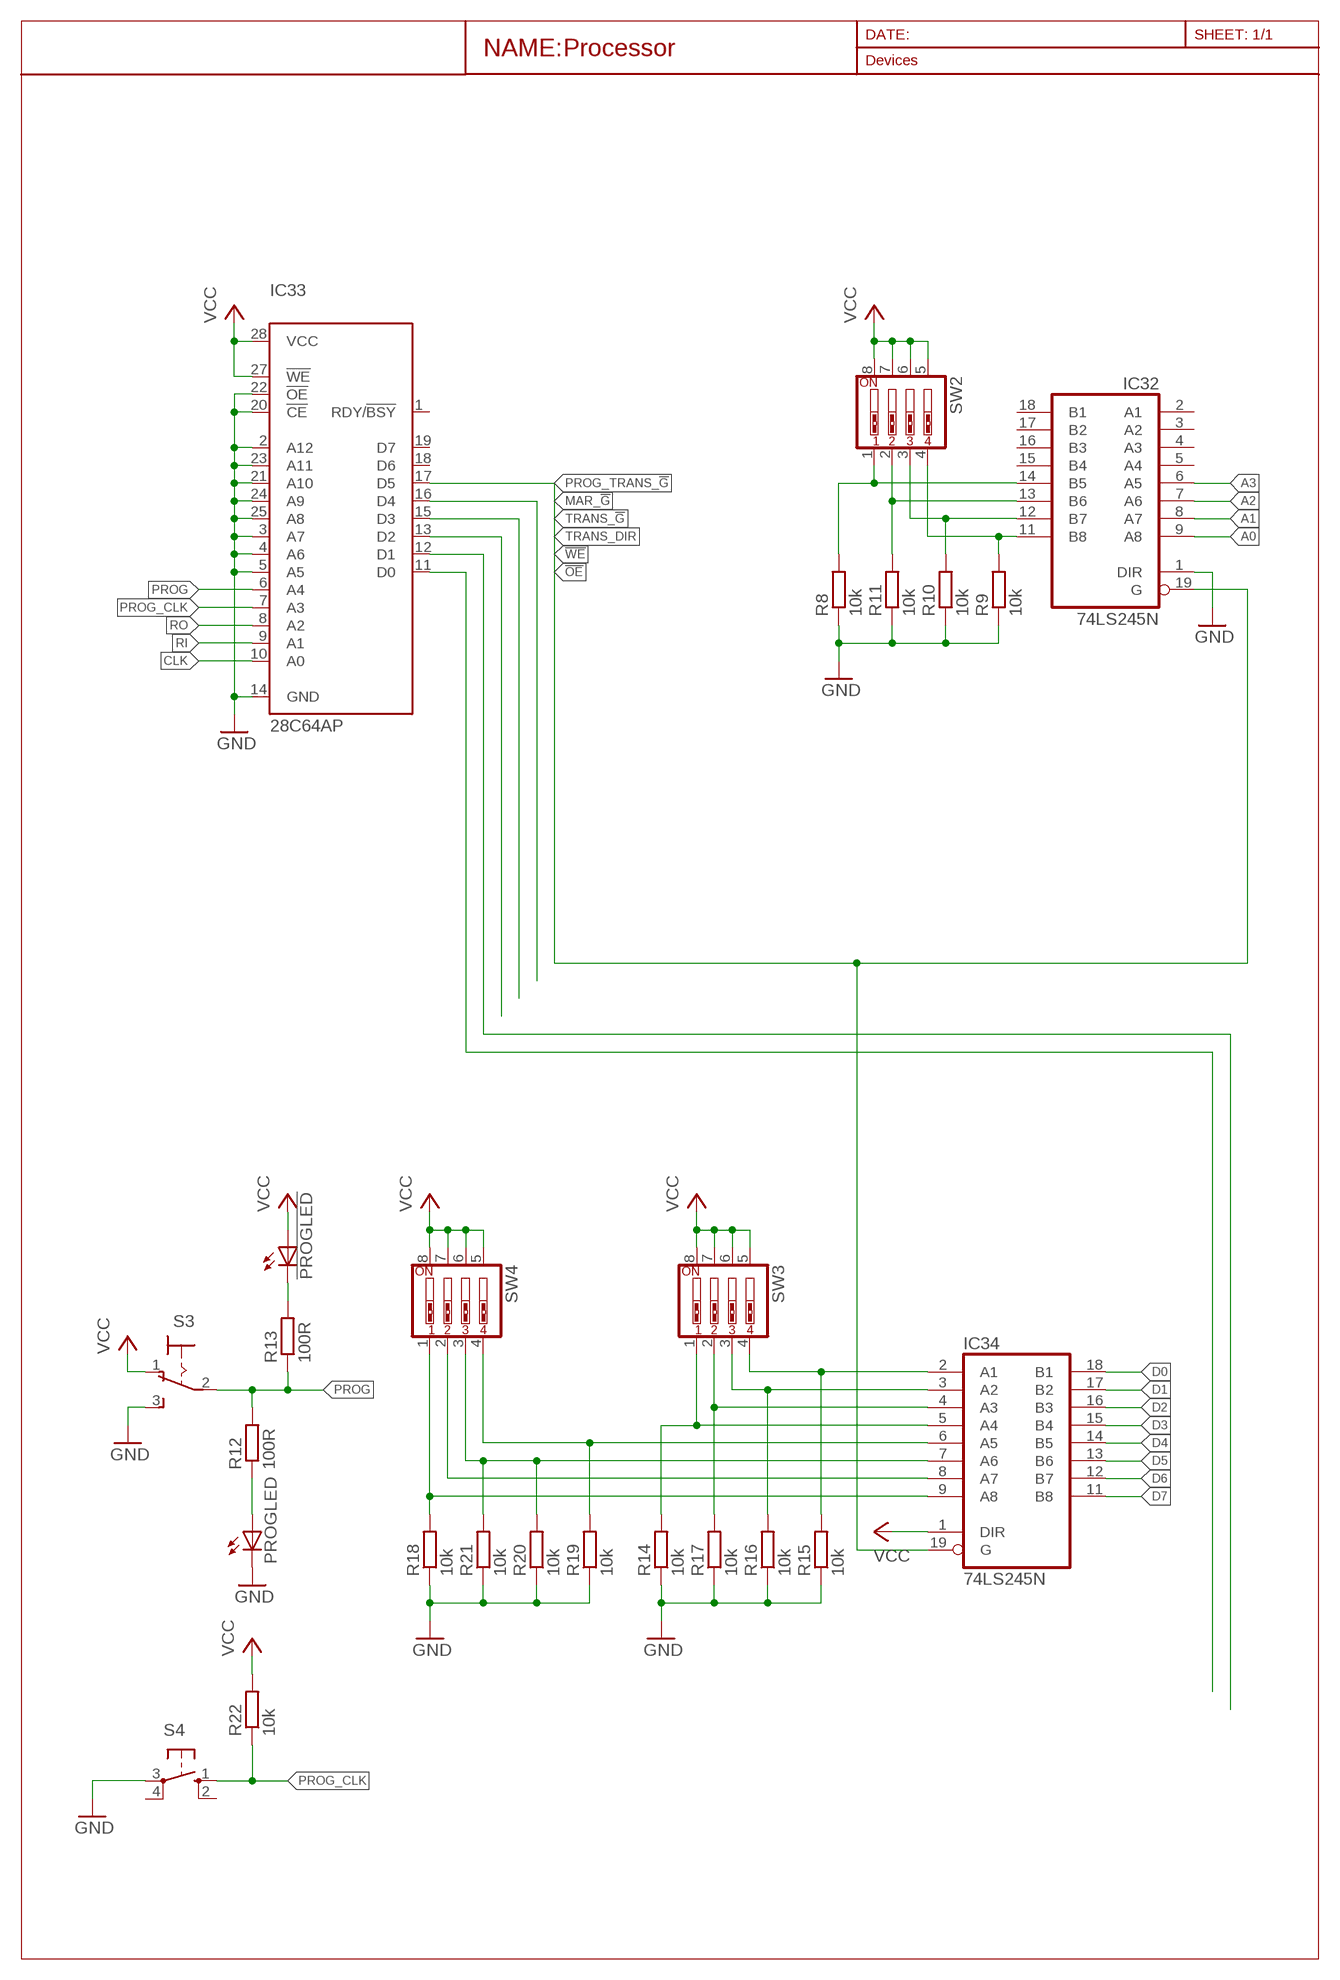
[diagram p9: schematic, module MEMCTRL, sheet 1]

### Parts
!PROGLED  LED5MM  [LED5MM]
IC32  74LS245N  [DIL20]
IC33  28C64AP  [DIL28-6]
IC34  74LS245N  [DIL20]
PROGLED  LED5MM  [LED5MM]
R8  10k  R-EU_0207/10  [0207/10]
R9  10k  R-EU_0207/10  [0207/10]
R10  10k  R-EU_0207/10  [0207/10]
R11  10k  R-EU_0207/10  [0207/10]
R12  100R  R-EU_0207/10  [0207/10]
R13  100R  R-EU_0207/10  [0207/10]
R14  10k  R-EU_0207/10  [0207/10]
R15  10k  R-EU_0207/10  [0207/10]
R16  10k  R-EU_0207/10  [0207/10]
R17  10k  R-EU_0207/10  [0207/10]
R18  10k  R-EU_0207/10  [0207/10]
R19  10k  R-EU_0207/10  [0207/10]
R20  10k  R-EU_0207/10  [0207/10]
R21  10k  R-EU_0207/10  [0207/10]
R22  10k  R-EU_0207/10  [0207/10]
S3  320-916  [320-916]
S4  10-XX  [B3F-10XX]
SW2  SW_DIP-4  [EDG-04]
SW3  SW_DIP-4  [EDG-04]
SW4  SW_DIP-4  [EDG-04]

### Nets
!OE: IC33.11(D0)
!WE: IC33.12(D1)
A0: IC32.9(A8)
A1: IC32.8(A7)
A2: IC32.7(A6)
A3: IC32.6(A5)
CLK: IC33.10(A0)
D0: IC34.18(B1)
D1: IC34.17(B2)
D2: IC34.16(B3)
D3: IC34.15(B4)
D4: IC34.14(B5)
D5: IC34.13(B6)
D6: IC34.12(B7)
D7: IC34.11(B8)
GND: IC32.1(DIR) IC33.2(A12) IC33.3(A7) IC33.4(A6) IC33.5(A5) IC33.14(GND) IC33.20(!CE) IC33.21(A10) IC33.22(!OE) IC33.23(A11) IC33.24(A9) IC33.25(A8) PROGLED.K(C) R8.1 R9.1 R10.1 R11.1 R14.1 R15.1 R16.1 R17.1 R18.1 R19.1 R20.1 R21.1 S3.3(S) S4.3(P)
MAR_!G: IC33.16(D4)
N$31: IC32.11(B8) R9.2 SW2.4
N$32: IC32.12(B7) R10.2 SW2.3
N$33: IC32.13(B6) R11.2 SW2.2
N$34: IC32.14(B5) R8.2 SW2.1
N$35: PROGLED.A R12.1
N$36: !PROGLED.K(C) R13.2
N$37: IC34.4(A3) R17.2 SW3.2
N$38: IC34.3(A2) R16.2 SW3.3
N$39: IC34.2(A1) R15.2 SW3.4
N$40: IC34.5(A4) R14.2 SW3.1
N$41: IC34.8(A7) SW4.2
N$42: IC34.7(A6) R20.2 R21.2 SW4.3
N$43: IC34.6(A5) R19.2 SW4.4
N$44: IC34.9(A8) R18.2 SW4.1
PROG: IC33.6(A4) R12.2 R13.1 S3.2(P)
PROG_CLK: IC33.7(A3) R22.1 S4.1(S)
PROG_TRANS_!G: IC32.19(G) IC33.17(D5) IC34.19(G)
RI: IC33.9(A1)
RO: IC33.8(A2)
TRANS_!G: IC33.15(D3)
TRANS_DIR: IC33.13(D2)
VCC: !PROGLED.A IC33.27(!WE) IC33.28(VCC) IC34.1(DIR) R22.2 S3.1(O) SW2.5 SW2.6 SW2.7 SW2.8 SW3.5 SW3.6 SW3.7 SW3.8 SW4.5 SW4.6 SW4.7 SW4.8
Unconnected: IC32.2(A1) IC32.3(A2) IC32.4(A3) IC32.5(A4) IC32.15(B4) IC32.16(B3) IC32.17(B2) IC32.18(B1) IC33.1(RDY/!BSY) IC33.18(D6) IC33.19(D7) S4.2(S1) S4.4(P1)

### Power pins joined to a net without a drawn wire
GND: IC32.10(GND) IC34.10(GND)
VCC: IC32.20(VCC) IC34.20(VCC)

### Library data of the parts
!PROGLED PROGLED = led:LED: LED OSRAM: - CHIPLED LG R971, LG N971, LY N971, LG Q971, LY Q971, LO R971, LY R971 LH N974, LH R974 LS Q976, LO Q976, LY Q976 LO Q996 - Hyper CHIPLED LW Q18S LB Q993, LB Q99A, LB R99A - SideLED LS A670, LO A670, LY A670, LG A670, LP A670 LB A673, LV A673, LT A673, LW A673 LH A674 LY A675 LS A676, LA A676, LO A676, LY A676, LW A676 LS A679, LY A679, LG A679 - Hyper Micro SIDELED® LS Y876, LA Y876, LO Y876, LY Y876 LT Y87S - SmartLED LW L88C, LW L88S LB L89C, LB L89S, LG L890 LS L89K, LO L89K, LY L89K LS L896, LA L896, LO L896, LY L896 - TOPLED LS T670, LO T670, LY T670, LG T670, LP T670 LSG T670, LSP T670, LSY T670, LOP T670, LYG T670 LG T671, LOG T671, LSG T671 LB T673, LV T673, LT T673, LW T673 LH T674 LS T676, LA T676, LO T676, LY T676, LB T676, LH T676, LSB T676, LW T676 LB T67C, LV T67C, LT T67C, LS T67K, LO T67K, LY T67K, LW E67C LS E67B, LA E67B, LO E67B, LY E67B, LB E67C, LV E67C, LT E67C LW T67C LS T679, LY T679, LG T679 LS T770, LO T770, LY T770, LG T770, LP T770 LB T773, LV T773, LT T773, LW T773 LH T774 LS E675, LA E675, LY E675, LS T675 LS T776, LA T776, LO T776, LY T776, LB T776 LHGB T686 LT T68C, LB T68C - Hyper Mini TOPLED® LB M676 - Mini TOPLED Santana® LG M470 LS M47K, LO M47K, LY M47K Source: http://www.osram.convergy.de LUXEON: - LUMILED® LXK2-PW12-R00, LXK2-PW12-S00, LXK2-PW14-U00, LXK2-PW14-V00 LXK2-PM12-R00, LXK2-PM12-S00, LXK2-PM14-U00 LXK2-PE12-Q00, LXK2-PE12-R00, LXK2-PE12-S00, LXK2-PE14-T00, LXK2-PE14-U00 LXK2-PB12-K00, LXK2-PB12-L00, LXK2-PB12-M00, LXK2-PB14-N00, LXK2-PB14-P00, LXK2-PB14-Q00 LXK2-PR12-L00, LXK2-PR12-M00, LXK2-PR14-Q00, LXK2-PR14-R00 LXK2-PD12-Q00, LXK2-PD12-R00, LXK2-PD12-S00 LXK2-PH12-R00, LXK2-PH12-S00 LXK2-PL12-P00, LXK2-PL12-Q00, LXK2-PL12-R00 Source: www.luxeon.com KINGBRIGHT: KA-3528ASYC Source: www.kingbright.com
IC32 IC34 = 74xx-eu:74*245: Octal BUS TRANSCEIVER, 3-state
IC33 = microchip:28*64A: CMOS EEPROM 64 K (8 K x 8), low voltage; MPN: AT28C64B-15PU; OC_FARNELL: 1631144; OC_NEWARK: 96K6557
R8-R22 = rcl:R-EU_: RESISTOR, European symbol; SPICEPREFIX: R
S3 = switch:320-916: TOGGLE SWITCH distributor RS Components
S4 = switch-omron:10-XX: OMRON SWITCH; MPN: B3F-1000; OC_FARNELL: 176432; OC_NEWARK: 36M3542
SW2-SW4 = special:SW_DIP-4: DIP SWITCH

## Module REGISTER_INSTR
Ports: 
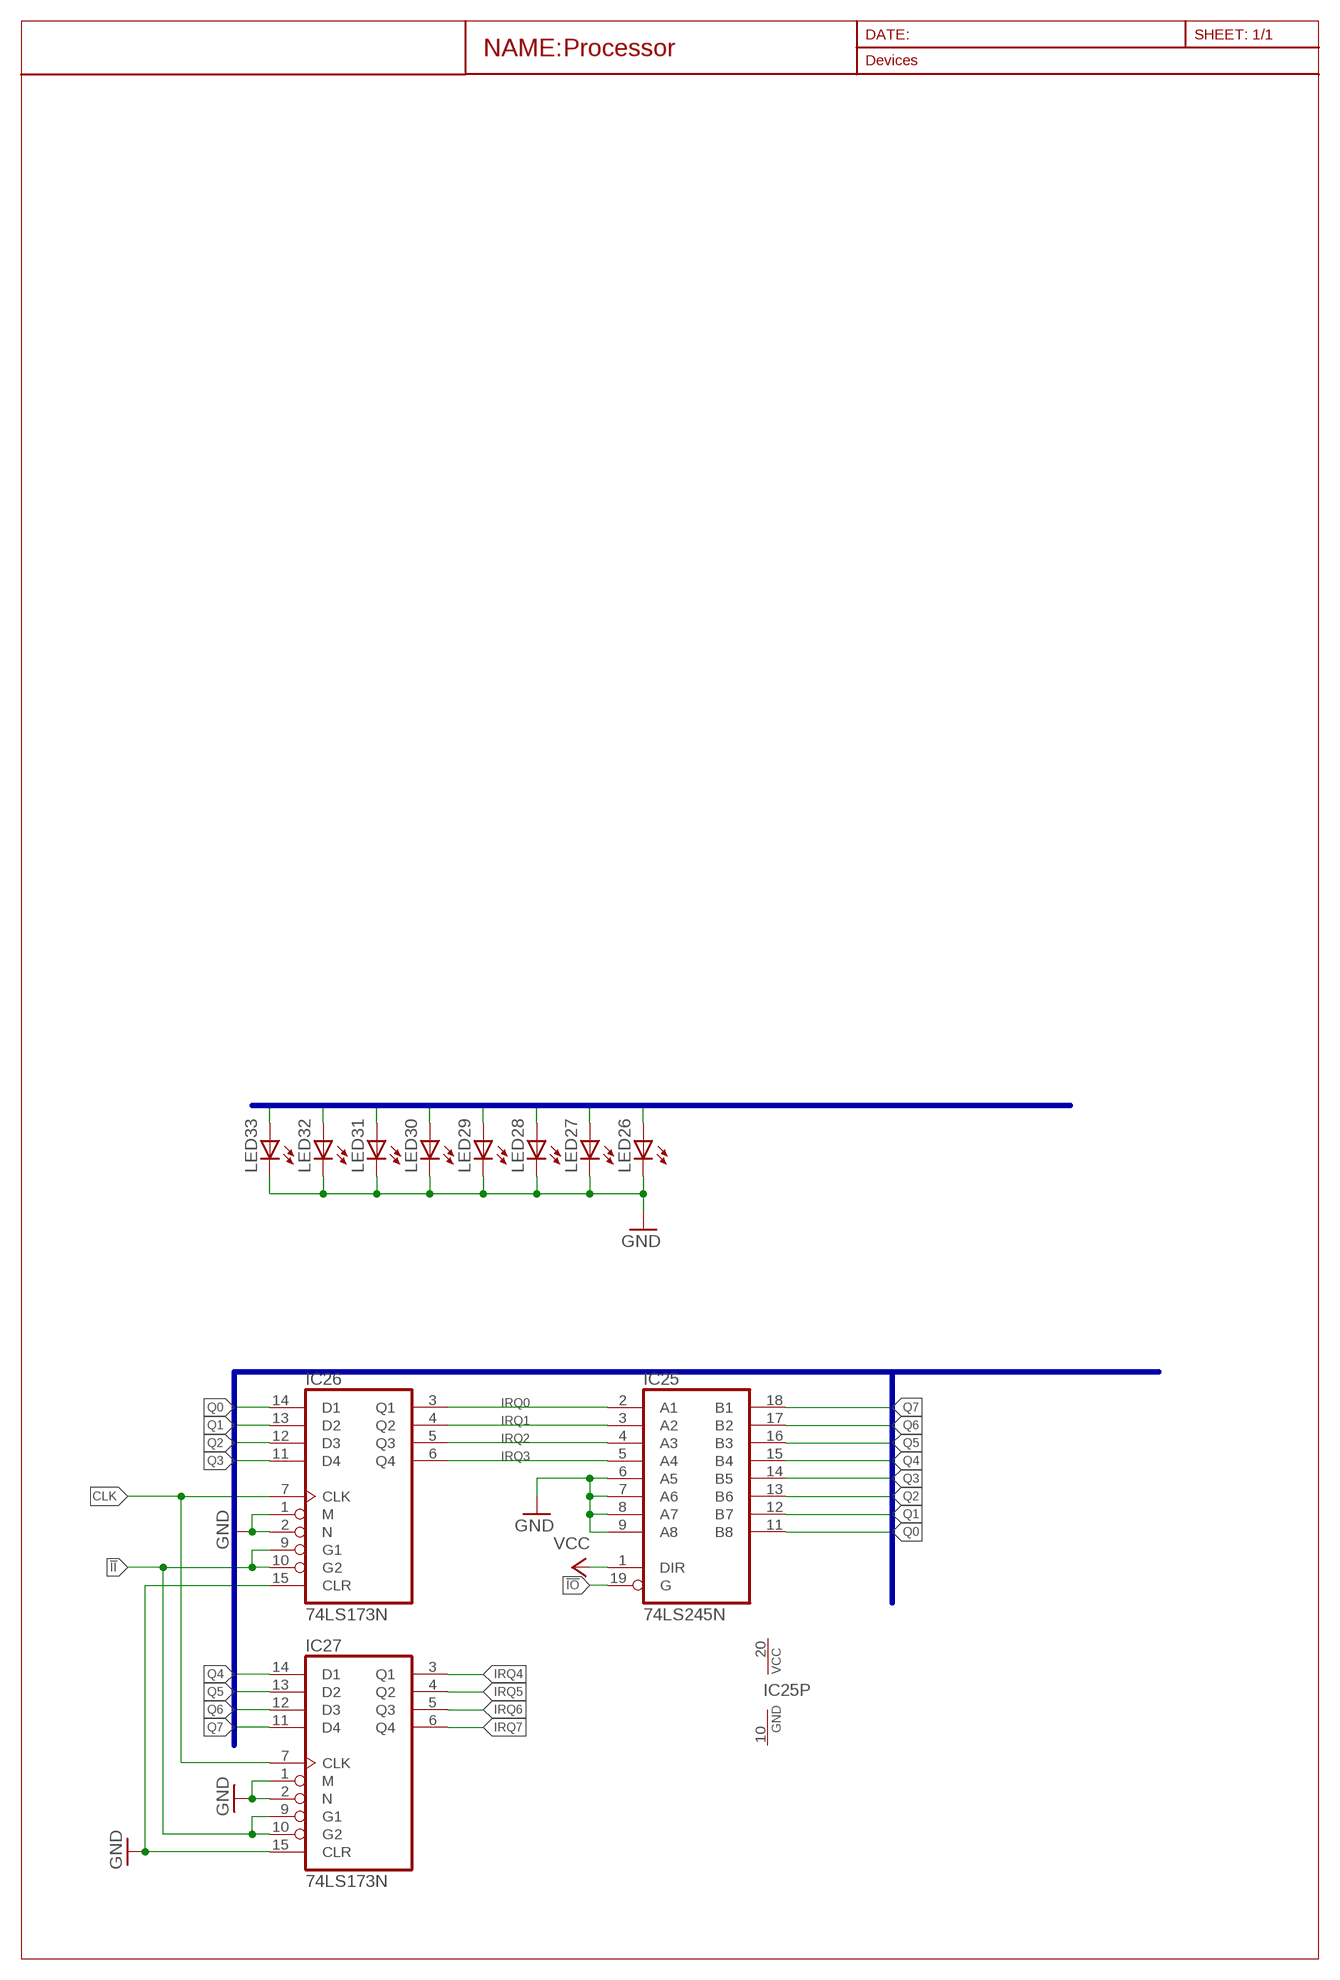
[diagram p10: schematic, module REGISTER_INSTR, sheet 1]

### Parts
IC25  74LS245N  [DIL20]
IC26  74LS173N  [DIL16]
IC27  74LS173N  [DIL16]
LED26  LED5MM  [LED5MM]
LED27  LED5MM  [LED5MM]
LED28  LED5MM  [LED5MM]
LED29  LED5MM  [LED5MM]
LED30  LED5MM  [LED5MM]
LED31  LED5MM  [LED5MM]
LED32  LED5MM  [LED5MM]
LED33  LED5MM  [LED5MM]

### Nets
!II: IC26.9(G1) IC26.10(G2) IC27.9(G1) IC27.10(G2)
!IO: IC25.19(G)
CLK: IC26.7(CLK) IC27.7(CLK)
GND: IC25.6(A5) IC25.7(A6) IC25.8(A7) IC25.9(A8) IC26.1(M) IC26.2(N) IC26.15(CLR) IC27.1(M) IC27.2(N) IC27.15(CLR) LED26.K(C) LED27.K(C) LED28.K(C) LED29.K(C) LED30.K(C) LED31.K(C) LED32.K(C) LED33.K(C)
IRQ0: IC25.2(A1) IC26.3(Q1) LED26.A
IRQ1: IC25.3(A2) IC26.4(Q2) LED27.A
IRQ2: IC25.4(A3) IC26.5(Q3) LED28.A
IRQ3: IC25.5(A4) IC26.6(Q4) LED29.A
IRQ4: IC27.3(Q1) LED30.A
IRQ5: IC27.4(Q2) LED31.A
IRQ6: IC27.5(Q3) LED32.A
IRQ7: IC27.6(Q4) LED33.A
Q0: IC25.11(B8) IC26.14(D1)
Q1: IC25.12(B7) IC26.13(D2)
Q2: IC25.13(B6) IC26.12(D3)
Q3: IC25.14(B5) IC26.11(D4)
Q4: IC25.15(B4) IC27.14(D1)
Q5: IC25.16(B3) IC27.13(D2)
Q6: IC25.17(B2) IC27.12(D3)
Q7: IC25.18(B1) IC27.11(D4)
VCC: IC25.1(DIR)

### Buses
MAIN_BUS:Q0,Q1,Q2,Q3,Q4,Q5,Q6,Q7
IRQ0,IRQ1,IRQ2,IRQ3,IRQ4,IRQ5,IRQ6,IRQ7

### Power pins joined to a net without a drawn wire
GND: IC25.10(GND) IC26.8(GND) IC27.8(GND)
VCC: IC25.20(VCC) IC26.16(VCC) IC27.16(VCC)

### Library data of the parts
IC25 = 74xx-eu:74*245: Octal BUS TRANSCEIVER, 3-state
IC26 IC27 = 74xx-eu:74*173: 4-bit D type REGISTER, 3-state
LED26-LED33 = led:LED: LED OSRAM: - CHIPLED LG R971, LG N971, LY N971, LG Q971, LY Q971, LO R971, LY R971 LH N974, LH R974 LS Q976, LO Q976, LY Q976 LO Q996 - Hyper CHIPLED LW Q18S LB Q993, LB Q99A, LB R99A - SideLED LS A670, LO A670, LY A670, LG A670, LP A670 LB A673, LV A673, LT A673, LW A673 LH A674 LY A675 LS A676, LA A676, LO A676, LY A676, LW A676 LS A679, LY A679, LG A679 - Hyper Micro SIDELED® LS Y876, LA Y876, LO Y876, LY Y876 LT Y87S - SmartLED LW L88C, LW L88S LB L89C, LB L89S, LG L890 LS L89K, LO L89K, LY L89K LS L896, LA L896, LO L896, LY L896 - TOPLED LS T670, LO T670, LY T670, LG T670, LP T670 LSG T670, LSP T670, LSY T670, LOP T670, LYG T670 LG T671, LOG T671, LSG T671 LB T673, LV T673, LT T673, LW T673 LH T674 LS T676, LA T676, LO T676, LY T676, LB T676, LH T676, LSB T676, LW T676 LB T67C, LV T67C, LT T67C, LS T67K, LO T67K, LY T67K, LW E67C LS E67B, LA E67B, LO E67B, LY E67B, LB E67C, LV E67C, LT E67C LW T67C LS T679, LY T679, LG T679 LS T770, LO T770, LY T770, LG T770, LP T770 LB T773, LV T773, LT T773, LW T773 LH T774 LS E675, LA E675, LY E675, LS T675 LS T776, LA T776, LO T776, LY T776, LB T776 LHGB T686 LT T68C, LB T68C - Hyper Mini TOPLED® LB M676 - Mini TOPLED Santana® LG M470 LS M47K, LO M47K, LY M47K Source: http://www.osram.convergy.de LUXEON: - LUMILED® LXK2-PW12-R00, LXK2-PW12-S00, LXK2-PW14-U00, LXK2-PW14-V00 LXK2-PM12-R00, LXK2-PM12-S00, LXK2-PM14-U00 LXK2-PE12-Q00, LXK2-PE12-R00, LXK2-PE12-S00, LXK2-PE14-T00, LXK2-PE14-U00 LXK2-PB12-K00, LXK2-PB12-L00, LXK2-PB12-M00, LXK2-PB14-N00, LXK2-PB14-P00, LXK2-PB14-Q00 LXK2-PR12-L00, LXK2-PR12-M00, LXK2-PR14-Q00, LXK2-PR14-R00 LXK2-PD12-Q00, LXK2-PD12-R00, LXK2-PD12-S00 LXK2-PH12-R00, LXK2-PH12-S00 LXK2-PL12-P00, LXK2-PL12-Q00, LXK2-PL12-R00 Source: www.luxeon.com KINGBRIGHT: KA-3528ASYC Source: www.kingbright.com

## Module CTRL_LOGIC
Ports: FI(out) J(out) CO(out) CE(out) OI(out) BI(out) SU(out) EO(out) AO(out) AI(out) II(out) IO(out) RO(out) RI(out) MI(out) HLT(out) CLR(out) !CLR(out) GND(pwr) VCC(pwr) IN0(in) IN1(in) IN2(in) IN3(in) !CLK(in)
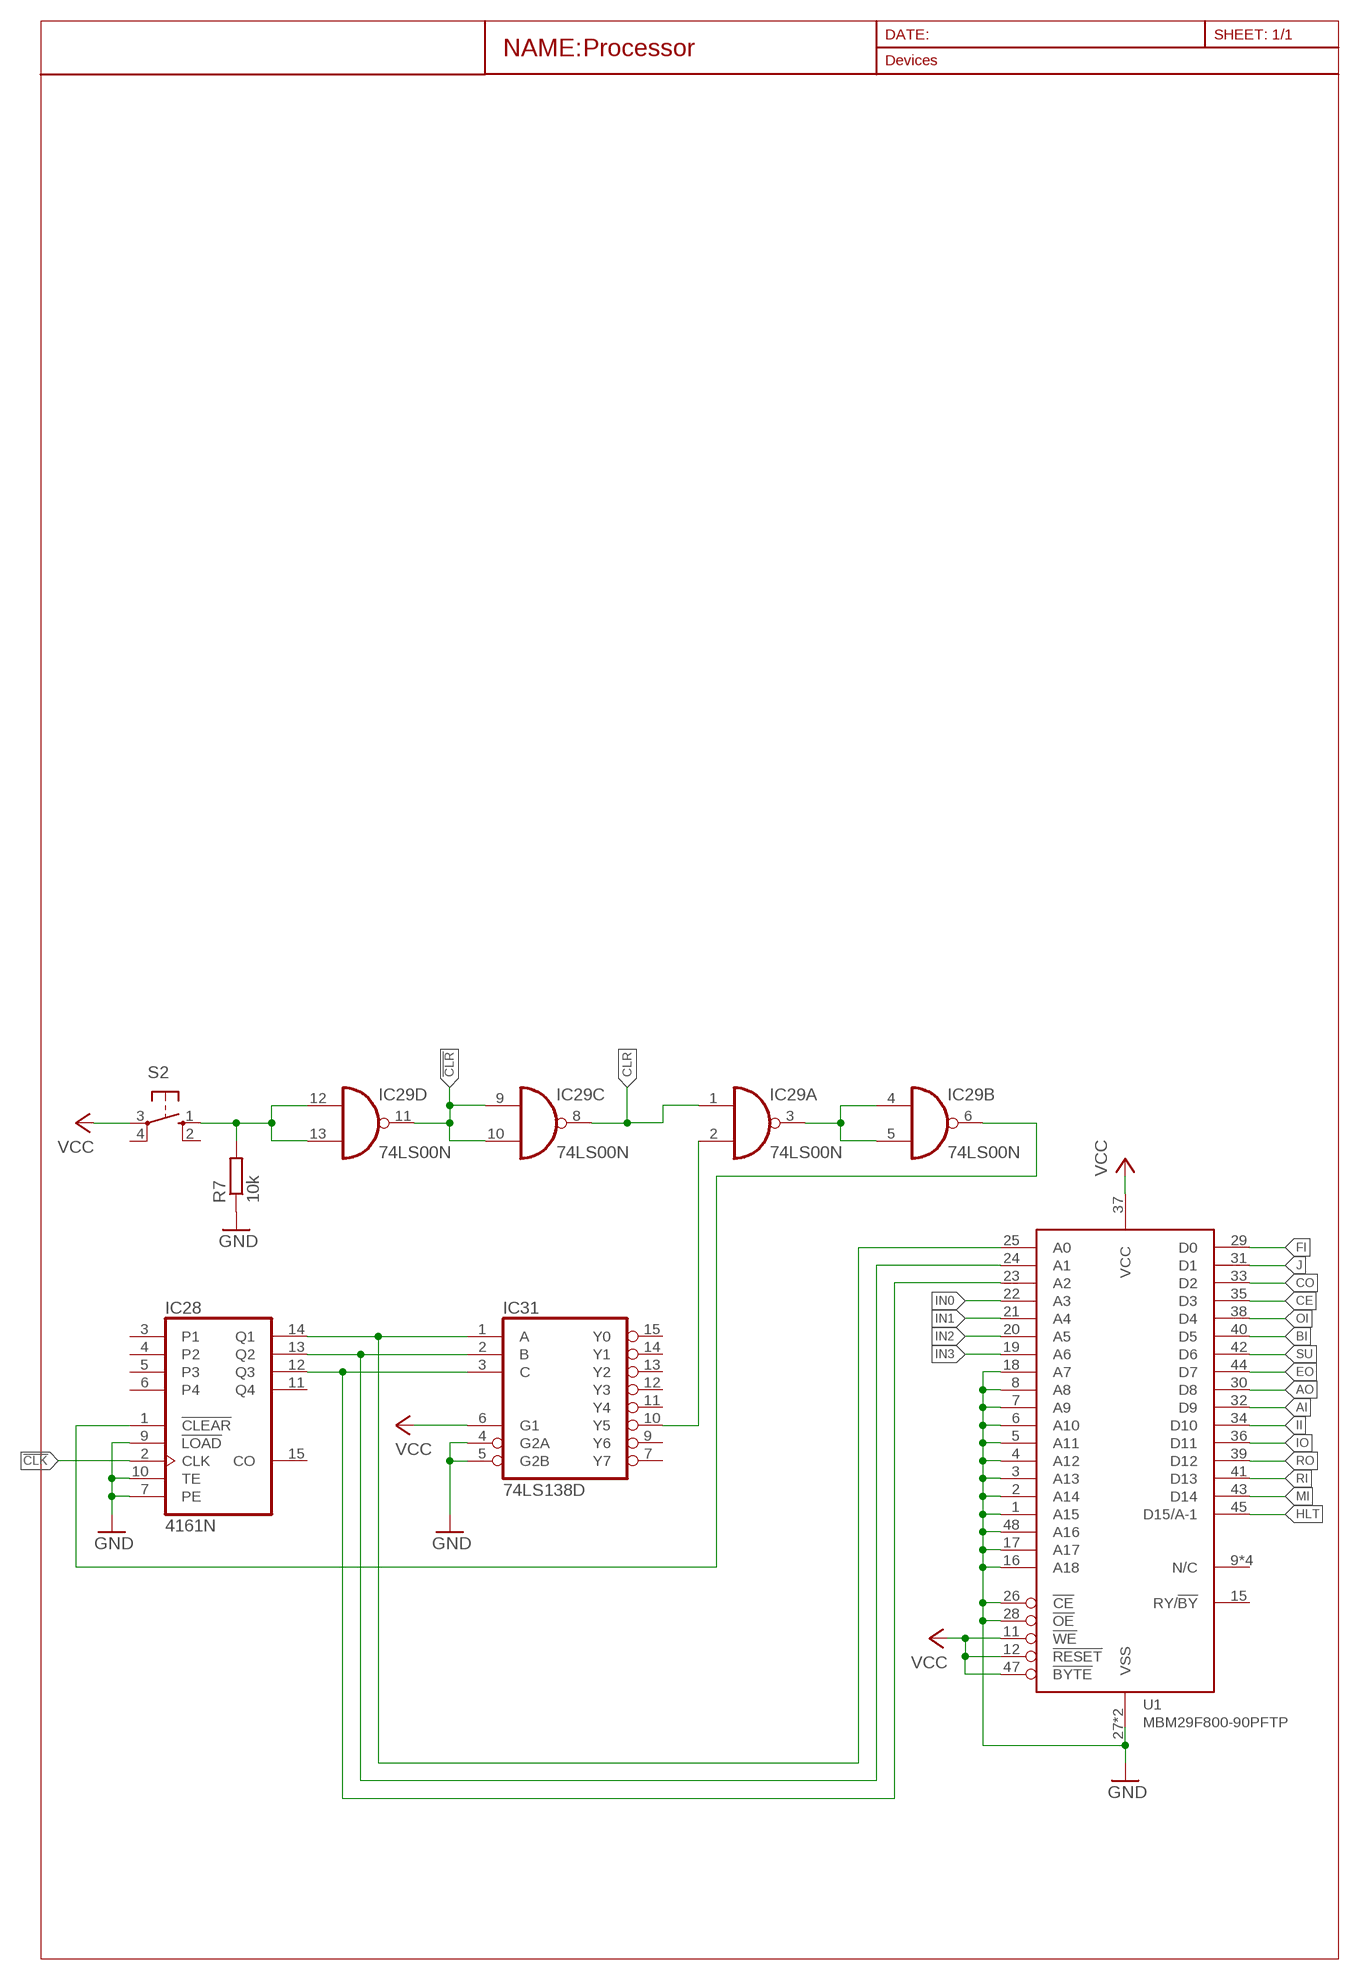
[diagram p11: schematic, module CTRL_LOGIC, sheet 1]

### Parts
IC28  4161N  [DIL16]
IC29  74LS00N  [DIL14]
IC31  74LS138D  [SO16]
R7  10k  R-EU_0207/10  [0207/10]
S2  10-XX  [B3F-10XX]
U1  MBM29F800-90PFTP  [TSOP48]

### Nets
!CLK: IC28.2(CLK)
!CLR: IC29.9(C:I0) IC29.10(C:I1) IC29.11(D:O)
AI: U1.32(D9)
AO: U1.30(D8)
BI: U1.40(D5)
CE: U1.35(D3)
CLR: IC29.1(A:I0) IC29.8(C:O)
CO: U1.33(D2)
EO: U1.44(D7)
FI: U1.29(D0)
GND: IC28.7(PE) IC28.9(!LOAD) IC28.10(TE) IC31.4(G2A) IC31.5(G2B) R7.1 U1.1(A15) U1.2(A14) U1.3(A13) U1.4(A12) U1.5(A11) U1.6(A10) U1.7(A9) U1.8(A8) U1.16(A18) U1.17(A17) U1.18(A7) U1.26(!CE) U1.27(VSS) U1.28(!OE) U1.46(VSS) U1.48(A16)
HLT: U1.45(D15/A-1)
II: U1.34(D10)
IN0: U1.22(A3)
IN1: U1.21(A4)
IN2: U1.20(A5)
IN3: U1.19(A6)
IO: U1.36(D11)
J: U1.31(D1)
MI: U1.43(D14)
N$20: IC29.12(D:I0) IC29.13(D:I1) R7.2 S2.1(S)
N$21: IC29.2(A:I1) IC31.10(Y5)
N$22: IC29.3(A:O) IC29.4(B:I0) IC29.5(B:I1)
N$23: IC28.1(!CLEAR) IC29.6(B:O)
N$24: IC28.14(Q1) IC31.1(A) U1.25(A0)
N$25: IC28.13(Q2) IC31.2(B) U1.24(A1)
N$26: IC28.12(Q3) IC31.3(C) U1.23(A2)
OI: U1.38(D4)
RI: U1.41(D13)
RO: U1.39(D12)
SU: U1.42(D6)
VCC: IC31.6(G1) S2.3(P) U1.11(!WE) U1.12(!RESET) U1.37(VCC) U1.47(!BYTE)
Unconnected: IC28.3(P1) IC28.4(P2) IC28.5(P3) IC28.6(P4) IC28.11(Q4) IC28.15(CO) IC31.7(Y7) IC31.9(Y6) IC31.11(Y4) IC31.12(Y3) IC31.13(Y2) IC31.14(Y1) IC31.15(Y0) S2.2(S1) S2.4(P1) U1.9(N/C) U1.10(N/C) U1.13(N/C) U1.14(N/C) U1.15(RY/!BY)

### Power pins joined to a net without a drawn wire
GND: IC29.7(P:GND) IC31.8(GND)
VCC: IC29.14(P:VCC) IC31.16(VCC)
VDD: IC28.16(VDD)
VSS: IC28.8(VSS)

### Library data of the parts
IC28 = 40xx:4161: Synchronous presettable 4-bit binary COUNTER
IC29 = 74xx-eu:74*00: Quad 2-input NAND gate
IC31 = 74xx-eu:74*138: 3-line to 8-line DECODER/DEMULTIPLEXER
R7 = rcl:R-EU_: RESISTOR, European symbol; SPICEPREFIX: R
S2 = switch-omron:10-XX: OMRON SWITCH; MPN: B3F-1000; OC_FARNELL: 176432; OC_NEWARK: 36M3542
U1 = ic:MBM29F800-90